# EAGLE design wfipic32host (EAGLE 9.6.2)
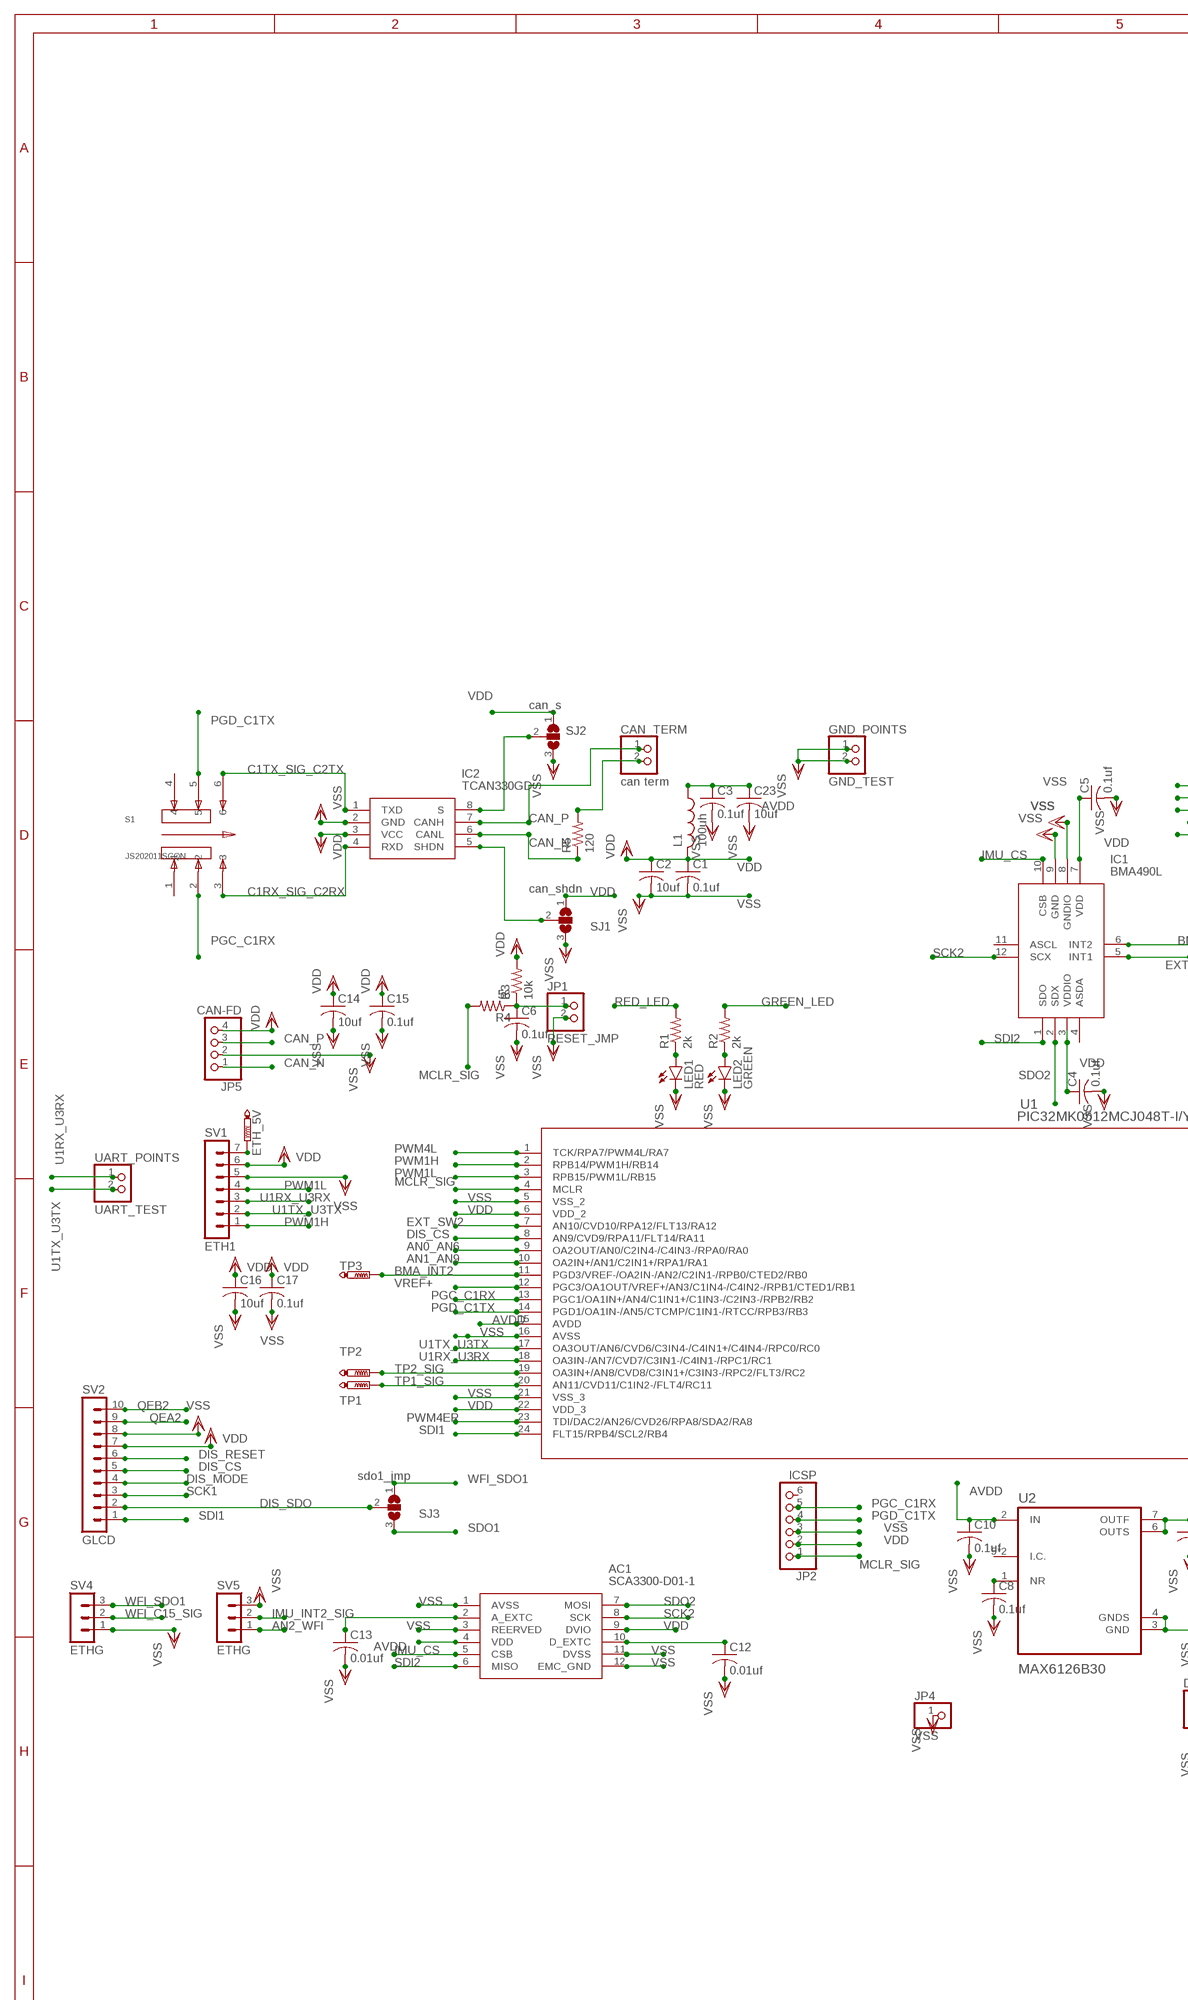
[diagram p0: schematic, sheet 1, part 1 of 2]
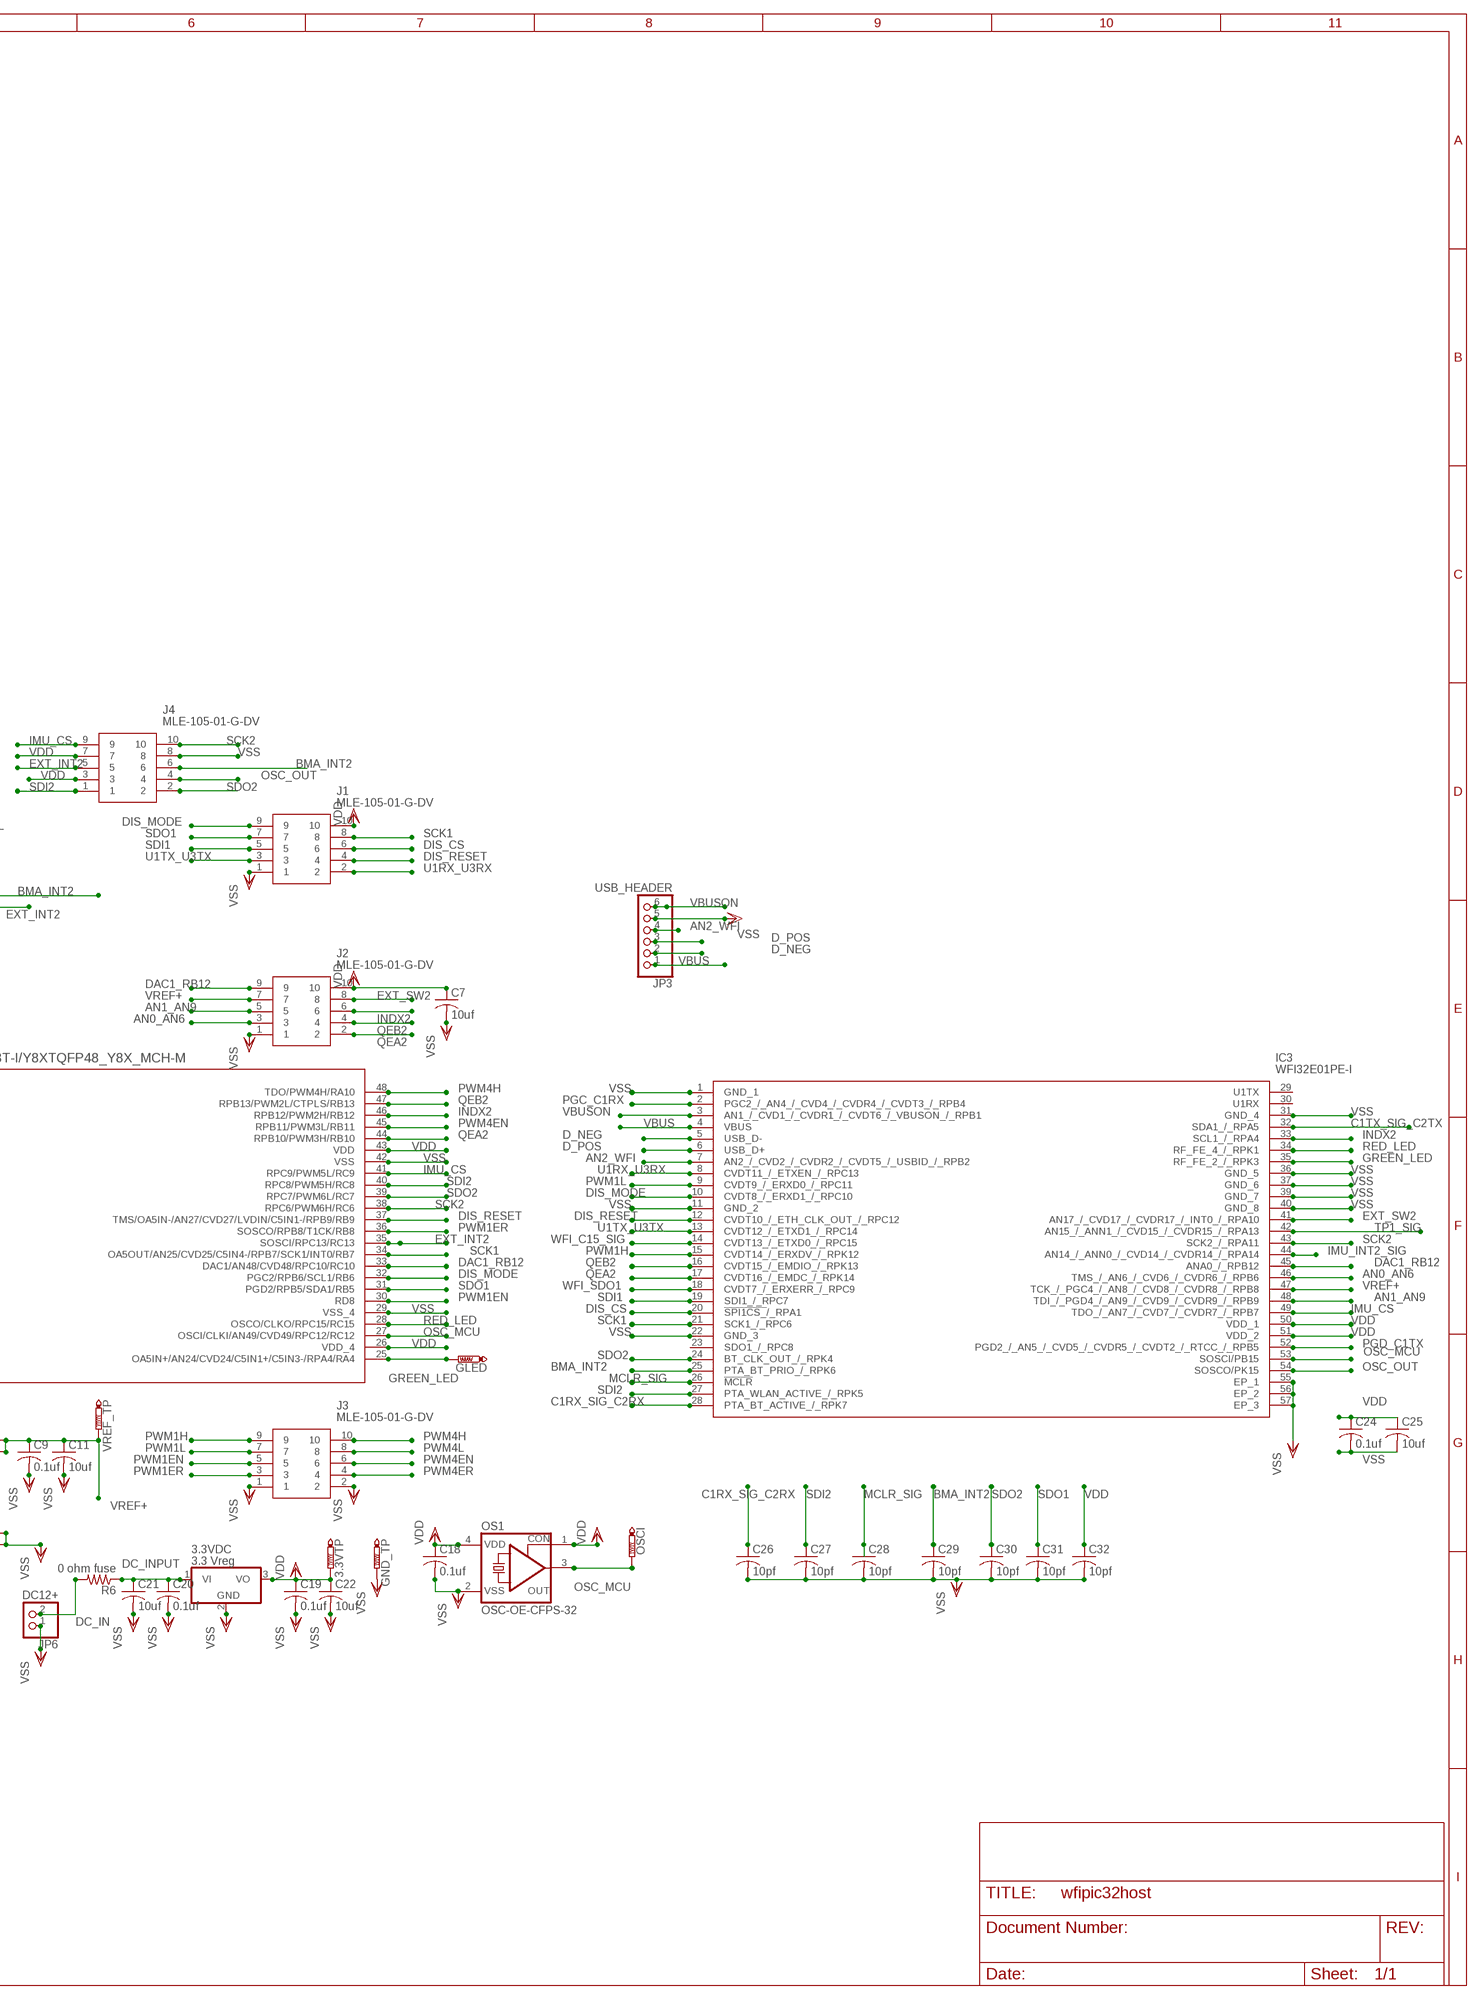
[diagram p1: schematic, sheet 1, part 2 of 2]

## Parts
3.3VDC  3.3 Vreg  7805TV  [TO220V]
3.3VTP  PTR1PAD1-13  [P1-13]
AC1  SCA3300-D01-1  [SCA3300]
C1  0.1uf  C-USC0805  [C0805]
C2  10uf  C-USC0805  [C0805]
C3  0.1uf  C-USC0805  [C0805]
C4  0.1uf  C-USC0805  [C0805]
C5  0.1uf  C-USC0805  [C0805]
C6  0.1uf  C-USC0805  [C0805]
C7  10uf  C-USC0805  [C0805]
C8  0.1uf  C-USC0805  [C0805]
C9  0.1uf  C-USC0805  [C0805]
C10  0.1uf  C-USC0805  [C0805]
C11  10uf  C-USC0805  [C0805]
C12  0.01uf  C-USC0805  [C0805]
C13  0.01uf  C-USC0805  [C0805]
C14  10uf  C-USC0805  [C0805]
C15  0.1uf  C-USC0805  [C0805]
C16  10uf  C-USC0805  [C0805]
C17  0.1uf  C-USC0805  [C0805]
C18  0.1uf  C-USC0805  [C0805]
C19  0.1uf  C-USC0805  [C0805]
C20  0.1uf  C-USC0805  [C0805]
C21  10uf  C-USC0805  [C0805]
C22  10uf  C-USC0805  [C0805]
C23  10uf  C-USC0805  [C0805]
C24  0.1uf  C-USC0805  [C0805]
C25  10uf  C-USC0805  [C0805]
C26  10pf  C-USC0402  [C0402]
C27  10pf  C-USC0402  [C0402]
C28  10pf  C-USC0402  [C0402]
C29  10pf  C-USC0402  [C0402]
C30  10pf  C-USC0402  [C0402]
C31  10pf  C-USC0402  [C0402]
C32  10pf  C-USC0402  [C0402]
CAN_TERM  can term  PINHD-1X2  [1X02]
ETH_5V  PTR1PAD1-13  [P1-13]
GLED  PTR1PAD1-13  [P1-13]
GND_POINTS  GND_TEST  PINHD-1X2  [1X02]
GND_TP  PTR1PAD1-13  [P1-13]
IC1  BMA490L  [BMA490L]
IC2  TCAN330GD  [SOIC127P600X175-8N]
IC3  WFI32E01PE-I  [WFI32E01PEI]
J1  MLE-105-01-G-DV  [MLE-105-01-G-DV]
J2  MLE-105-01-G-DV  [MLE-105-01-G-DV]
J3  MLE-105-01-G-DV  [MLE-105-01-G-DV]
J4  MLE-105-01-G-DV  [MLE-105-01-G-DV]
JP1  RESET_JMP  PINHD-1X2  [1X02]
JP2  ICSP  PINHD-1X6  [1X06]
JP3  USB_HEADER  PINHD-1X6  [1X06]
JP4  VSS  PINHD-1X1  [1X01]
JP5  CAN-FD  PINHD-1X4/90  [1X04/90]
JP6  DC12+  PINHD-1X2  [1X02]
L1  100uh  L-USL3216C  [L3216C]
LED1  RED  LEDCHIPLED_0603  [CHIPLED_0603]
LED2  GREEN  LEDCHIPLED_0603  [CHIPLED_0603]
OS1  OSC-OE-CFPS-32  [7.2X5.2-4-PAD]
OSCI  PTR1PAD1-13  [P1-13]
R1  2k  R-US_M0805  [M0805]
R2  2k  R-US_M0805  [M0805]
R3  10k  R-US_M0805  [M0805]
R4  56  R-US_M0805  [M0805]
R5  120  R-US_M0805  [M0805]
R6  0 ohm fuse  R-US_M1206  [M1206]
S1  JS202011SCQN  [SW_JS202011SCQN]
SJ1  can_shdn  SJ2W  [SJ_2]
SJ2  can_s  SJ2W  [SJ_2]
SJ3  sdo1_jmp  SJ2W  [SJ_2]
SV1  ETH1  MA07-1  [MA07-1]
SV2  GLCD  MA10-1  [MA10-1]
SV4  ETHG  MA03-1  [MA03-1]
SV5  ETHG  MA03-1  [MA03-1]
TP1  PTR1PAD1-13  [P1-13]
TP2  PTR1PAD1-13  [P1-13]
TP3  PTR1PAD1-13  [P1-13]
U1  PIC32MK0512MCJ048T-I/Y8XTQFP48_Y8X_MCH-M  [TQFP48_Y8X_MCH-M]
U2  MAX6126B30  [SOP65P490X110-8N]
UART_POINTS  UART_TEST  PINHD-1X2  [1X02]
VREF_TP  PTR1PAD1-13  [P1-13]

## Nets
AN0_AN6: IC3.46(TMS_/_AN6_/_CVD6_/_CVDR6_/_RPB6) J2.3 U1.9(OA2OUT/AN0/C2IN4-/C4IN3-/RPA0/RA0)
AN1_AN9: IC3.48(TDI_/_PGD4_/_AN9_/_CVD9_/_CVDR9_/_RPB9) J2.5 U1.10(OA2IN+/AN1/C2IN1+/RPA1/RA1)
AN2_WFI: IC3.7(AN2_/_CVD2_/_CVDR2_/_CVDT5_/_USBID_/_RPB2) JP3.4 SV5.1
AVDD [ncurrent]: AC1.4(VDD) C3.1 C10.1 C23.1 L1.1 U1.15(AVDD) U2.2(IN)
BMA_INT2: C29.1 IC1.6(INT2) IC3.25(PTA_BT_PRIO_/_RPK6) J4.6 TP3.TP U1.11(PGD3/VREF-/OA2IN-/AN2/C2IN1-/RPB0/CTED2/RB0)
C1RX_SIG_C2RX: C26.1 IC2.4(RXD) IC3.28(PTA_BT_ACTIVE_/_RPK7) S1.3
C1TX_SIG_C2TX: IC2.1(TXD) IC3.32(SDA1_/_RPA5) S1.6
CAN_N [diff_can]: IC2.6(CANL) JP5.1 R5.1
CAN_P [diff_can]: CAN_TERM.1 IC2.7(CANH) JP5.3
D_NEG: IC3.5(USB_D-) JP3.2
D_POS: IC3.6(USB_D+) JP3.3
DAC1_RB12: IC3.45(ANA0_/_RPB12) J2.9 U1.33(DAC1/AN48/CVD48/RPC10/RC10)
DC_IN [icurrent]: JP6.2 R6.2
DC_INPUT [icurrent]: 3.3VDC.1(VI) C20.1 C21.1 R6.1
DIS_CS: IC3.20(!SPI1CS_!/_RPA1) J1.6 SV2.5 U1.8(AN9/CVD9/RPA11/FLT14/RA11)
DIS_MODE: IC3.10(CVDT8_/_ERXD1_/_RPC10) J1.9 SV2.4 U1.32(PGC2/RPB6/SCL1/RB6)
DIS_RESET: IC3.12(CVDT10_/_ETH_CLK_OUT_/_RPC12) J1.4 SV2.6 U1.37(TMS/OA5IN-/AN27/CVD27/LVDIN/C5IN1-/RPB9/RB9)
DIS_SDO: SJ3.2 SV2.2
EXT_INT2: IC1.5(INT1) J4.5 U1.35(SOSCI/RPC13/RC13)
EXT_SW2: IC3.41(AN17_/_CVD17_/_CVDR17_/_INT0_/_RPA10) J2.8 U1.7(AN10/CVD10/RPA12/FLT13/RA12)
GREEN_LED: GLED.TP IC3.35(RF_FE_2_/_RPK3) R2.2 U1.25(OA5IN+/AN24/CVD24/C5IN1+/C5IN3-/RPA4/RA4)
IMU_CS: AC1.5(CSB) IC1.10(CSB) IC3.49(TDO_/_AN7_/_CVD7_/_CVDR7_/_RPB7) J4.9 U1.41(RPC9/PWM5L/RC9)
IMU_INT2_SIG: IC3.44(AN14_/_ANN0_/_CVD14_/_CVDR14_/_RPA14) SV5.2
INDX2: IC3.33(SCL1_/_RPA4) J2.6 U1.46(RPB12/PWM2H/RB12)
MCLR_SIG: C28.1 IC3.26(!MCLR) JP2.1 R4.2 U1.4(MCLR)
N$1: LED1.A R1.1
N$2: LED2.A R2.1
N$3: C6.1 JP1.1 R3.1 R4.1
N$4: C8.1 U2.1(NR)
N$7: AC1.10(D_EXTC) C12.1
N$8: ETH_5V.TP SV1.7
N$9: AC1.2(A_EXTC) C13.1
N$12: IC2.5(SHDN) SJ1.2
N$13: IC2.8(S) SJ2.2
N$15: CAN_TERM.2 R5.2
OSC_MCU: IC3.53(SOSCI/PB15) OS1.3(OUT) OSCI.TP U1.27(OSCI/CLKI/AN49/CVD49/RPC12/RC12)
OSC_OUT: IC3.54(SOSCO/PK15) J4.4
PGC_C1RX: IC3.2(PGC2_/_AN4_/_CVD4_/_CVDR4_/_CVDT3_/_RPB4) JP2.5 S1.2 U1.13(PGC1/OA1IN+/AN4/C1IN1+/C1IN3-/C2IN3-/RPB2/RB2)
PGD_C1TX: IC3.52(PGD2_/_AN5_/_CVD5_/_CVDR5_/_CVDT2_/_RTCC_/_RPB5) JP2.4 S1.5 U1.14(PGD1/OA1IN-/AN5/CTCMP/C1IN1-/RTCC/RPB3/RB3)
PWM1EN: J3.5 U1.30(RD8)
PWM1ER: J3.3 U1.36(SOSCO/RPB8/T1CK/RB8)
PWM1H: IC3.15(CVDT14_/_ERXDV_/_RPK12) J3.9 SV1.1 U1.2(RPB14/PWM1H/RB14)
PWM1L: IC3.9(CVDT9_/_ERXD0_/_RPC11) J3.7 SV1.4 U1.3(RPB15/PWM1L/RB15)
PWM4EN: J3.6 U1.45(RPB11/PWM3L/RB11)
PWM4ER: J3.4 U1.23(TDI/DAC2/AN26/CVD26/RPA8/SDA2/RA8)
PWM4H: J3.10 U1.48(TDO/PWM4H/RA10)
PWM4L: J3.8 U1.1(TCK/RPA7/PWM4L/RA7)
QEA2: IC3.17(CVDT16_/_EMDC_/_RPK14) J2.2 SV2.9 U1.44(RPB10/PWM3H/RB10)
QEB2: IC3.16(CVDT15_/_EMDIO_/_RPK13) J2.4 SV2.10 U1.47(RPB13/PWM2L/CTPLS/RB13)
RED_LED: IC3.34(RF_FE_4_/_RPK1) R1.2 U1.28(OSCO/CLKO/RPC15/RC15)
SCK1: IC3.21(SCK1_/_RPC6) J1.8 SV2.3 U1.34(OA5OUT/AN25/CVD25/C5IN4-/RPB7/SCK1/INT0/RB7)
SCK2: AC1.8(SCK) IC1.12(SCX) IC3.43(SCK2_/_RPA11) J4.10 U1.38(RPC6/PWM6H/RC6)
SDI1: IC3.19(SDI1_/_RPC7) J1.5 SV2.1 U1.24(FLT15/RPB4/SCL2/RB4)
SDI2: AC1.6(MISO) C27.1 IC1.1(SDO) IC3.27(PTA_WLAN_ACTIVE_/_RPK5) J4.1 U1.40(RPC8/PWM5H/RC8)
SDO1: C31.1 J1.7 SJ3.3 U1.31(PGD2/RPB5/SDA1/RB5)
SDO2: AC1.7(MOSI) C30.1 IC1.2(SDX) IC3.24(BT_CLK_OUT_/_RPK4) J4.2 U1.39(RPC7/PWM6L/RC7)
TP1_SIG: IC3.42(AN15_/_ANN1_/_CVD15_/_CVDR15_/_RPA13) TP1.TP U1.20(AN11/CVD11/C1IN2-/FLT4/RC11)
TP2_SIG: TP2.TP U1.19(OA3IN+/AN8/CVD8/C3IN1+/C3IN3-/RPC2/FLT3/RC2)
U1RX_U3RX: IC3.8(CVDT11_/_ETXEN_/_RPC13) J1.2 SV1.3 U1.18(OA3IN-/AN7/CVD7/C3IN1-/C4IN1-/RPC1/RC1) UART_POINTS.1
U1TX_U3TX: IC3.13(CVDT12_/_ETXD1_/_RPC14) J1.3 SV1.2 U1.17(OA3OUT/AN6/CVD6/C3IN4-/C4IN1+/C4IN4-/RPC0/RC0) UART_POINTS.2
VBUS: IC3.4(VBUS) JP3.1
VBUSON: IC3.3(AN1_/_CVD1_/_CVDR1_/_CVDT6_/_VBUSON_/_RPB1) JP3.6
VDD [ncurrent]: 3.3VDC.3(VO) 3.3VTP.TP AC1.9(DVIO) C1.1 C2.1 C4.1 C5.1 C7.1 C14.1 C15.1 C16.1 C17.1 C18.1 C19.1 C22.1 C24.1 C25.1 C32.1 IC1.3(VDDIO) IC1.7(VDD) IC2.3(VCC) IC3.50(VDD_1) IC3.51(VDD_2) J1.10 J2.10 J4.3 J4.7 JP2.2 JP5.4 L1.2 OS1.1(CON) OS1.4(VDD) R3.2 SJ1.1 SJ2.1 SV1.6 SV2.7 U1.6(VDD_2) U1.22(VDD_3) U1.26(VDD_4) U1.43(VDD)
VREF+: C9.1 C11.1 IC3.47(TCK_/_PGC4_/_AN8_/_CVD8_/_CVDR8_/_RPB8) J2.7 U1.12(PGC3/OA1OUT/VREF+/AN3/C1IN4-/C4IN2-/RPB1/CTED1/RB1) U2.6(OUTS) U2.7(OUTF) VREF_TP.TP
VSS [ncurrent]: 3.3VDC.2(GND) AC1.1(AVSS) AC1.3(REERVED) AC1.11(DVSS) AC1.12(EMC_GND) C1.2 C2.2 C3.2 C4.2 C5.2 C6.2 C7.2 C8.2 C9.2 C10.2 C11.2 C12.2 C13.2 C14.2 C15.2 C16.2 C17.2 C18.2 C19.2 C20.2 C21.2 C22.2 C23.2 C24.2 C25.2 C26.2 C27.2 C28.2 C29.2 C30.2 C31.2 C32.2 GND_POINTS.1 GND_POINTS.2 GND_TP.TP IC1.8(GNDIO) IC1.9(GND) IC2.2(GND) IC3.1(GND_1) IC3.11(GND_2) IC3.22(GND_3) IC3.31(GND_4) IC3.36(GND_5) IC3.37(GND_6) IC3.39(GND_7) IC3.40(GND_8) IC3.55(EP_1) IC3.56(EP_2) IC3.57(EP_3) J1.1 J2.1 J3.1 J3.2 J4.8 JP1.2 JP2.3 JP3.5 JP4.1 JP5.2 JP6.1 LED1.C LED2.C OS1.2(VSS) SJ1.3 SJ2.3 SV1.5 SV2.8 SV4.1 SV5.3 U1.5(VSS_2) U1.16(AVSS) U1.21(VSS_3) U1.29(VSS_4) U1.42(VSS) U2.3(GND) U2.4(GNDS)
WFI_C15_SIG: IC3.14(CVDT13_/_ETXD0_/_RPC15) SV4.2
WFI_SDO1: IC3.18(CVDT7_/_ERXERR_/_RPC9) SJ3.1 SV4.3
Unconnected: IC1.4(ASDA) IC1.11(ASCL) IC3.23(SDO1_/_RPC8) IC3.29(U1TX) IC3.30(U1RX) JP2.6 S1.1 S1.4 U2.5(I.C.) U2.8(I.C.)

## Library data of the parts
3.3VDC = linear:78*: Positive VOLTAGE REGULATOR Source: http://cache.national.com/ds/LM/LM78L05.pdf http://www.fairchildsemi.com/ds/LM/LM7805.pdf
3.3VTP ETH_5V GLED GND_TP OSCI TP1-TP3 VREF_TP = testpad:PTR1: TEST PIN
AC1 = SCA3300-D01-1:SCA3300-D01-1: Murata SCA3300-D01-1, 3-Axis Accelerometer, +/-1.5 +/-6g, 3 3.6 V, SPI, DFL/SMD 12-Pin Source: Datasheet <https://www.murata.com/~/media/webrenewal/products/sensor/accel/sca3300/sca3300-d01 industrial 3-axis accelerometer datasheet _a1.ashx> Check availability <https://pricing.snapeda.com/parts/SCA3300-D01-1/Murata%20Electronics/view-part?ref=eda>; AVAILABILITY: In Stock; DESCRIPTION: Accelerometer X, Y, Z Axis ±1.5g, 3g, 6g - -; MF: Murata Electronics; MP: SCA3300-D01-1; PACKAGE: Nonstandard Murata; PRICE: None; PURCHASE-URL: https://pricing.snapeda.com/search/part/SCA3300-D01-1/?ref=eda
C1-C32 = rcl:C-US: CAPACITOR, American symbol; SPICEPREFIX: C
CAN_TERM GND_POINTS JP1 JP6 UART_POINTS = pinhead:PINHD-1X2: PIN HEADER
IC1 = SamacSys_Parts:BMA490L: Accelerometers High-performance longevity acceleration sensor Source: Datasheet <https://www.mouser.es/datasheet/2/783/bst-bma490l-ds000-1878796.pdf>; DESCRIPTION: Accelerometers High-performance longevity acceleration sensor; HEIGHT: 1mm; MANUFACTURER_NAME: Bosch Sensortec; MANUFACTURER_PART_NUMBER: BMA490L; MOUSER_PART_NUMBER: 262-BMA490L; MOUSER_PRICE-STOCK: https://www.mouser.co.uk/ProductDetail/Bosch-Sensortec/BMA490L?qs=7MVldsJ5UawjTpioRTbJPQ%3D%3D
IC2 = TCAN330GD:TCAN330GD: 3.3-V CAN Transceivers with CAN FD (Flexible Data Rate) Source: Datasheet <http://www.ti.com/lit/gpn/tcan330g>; DESCRIPTION: 3.3-V CAN Transceivers with CAN FD (Flexible Data Rate); HEIGHT: 1.75mm; MANUFACTURER_NAME: Texas Instruments; MANUFACTURER_PART_NUMBER: TCAN330GD; MOUSER_PART_NUMBER: 595-TCAN330GD; MOUSER_PRICE-STOCK: https://www.mouser.co.uk/ProductDetail/Texas-Instruments/TCAN330GD?qs=9DwIlvx97ae6H3qgocd9Aw%3D%3D
IC3 = WFI32E01PE-I:WFI32E01PE-I: WiFi Modules - 802.11 54-pad Wi-Fi SoC module, 802.11 b/g/n, 1MB Flash, 320KB RAM, Crypto, PCB ant Source: Datasheet <https://ww1.microchip.com/downloads/aemDocuments/documents/WSG/ProductDocuments/DataSheets/PIC32MZ1025W104-MCU-and-WFI32E01-Module-with-Wi-Fi-and-Hardware-based-Security-Accelerator-Data-Sheet-DS70005425.pdf>; DESCRIPTION: WiFi Modules - 802.11 54-pad Wi-Fi SoC module, 802.11 b/g/n, 1MB Flash, 320KB RAM, Crypto, PCB ant; HEIGHT: 2.6mm; MANUFACTURER_NAME: Microchip; MANUFACTURER_PART_NUMBER: WFI32E01PE-I; MOUSER_PART_NUMBER: 579-WFI32E01PE-I; MOUSER_PRICE-STOCK: https://www.mouser.co.uk/ProductDetail/Microchip-Technology-Atmel/WFI32E01PE-I?qs=W%2FMpXkg%252BdQ6FpmXU%2Fd7PKw%3D%3D
J1-J4 = MLE-105-01-G-DV:MLE-105-01-G-DV: 10 Position, 1.00 mm Tiger Beam™ Cost-Effective Single Beam Socket Strip Source: Datasheet <http://suddendocs.samtec.com/prints/mle-1xx-xx-x-dv-x-mkt1.pdf>; DESCRIPTION: 10 Position, 1.00 mm Tiger Beam&trade; Cost-Effective Single Beam Socket Strip; HEIGHT: mm; MANUFACTURER_NAME: SAMTEC; MANUFACTURER_PART_NUMBER: MLE-105-01-G-DV; MOUSER_PART_NUMBER: 200-MLE10501GDV; MOUSER_PRICE-STOCK: https://www.mouser.co.uk/ProductDetail/Samtec/MLE-105-01-G-DV?qs=rU5fayqh%252BE2dXiDvl4XeQQ%3D%3D
JP2 JP3 = pinhead:PINHD-1X6: PIN HEADER
JP4 = pinhead:PINHD-1X1: PIN HEADER
JP5 = pinhead:PINHD-1X4: PIN HEADER
L1 = rcl:L-US: INDUCTOR, American symbol; SPICEPREFIX: L
LED1 LED2 = led:LED: LED OSRAM: - CHIPLED LG R971, LG N971, LY N971, LG Q971, LY Q971, LO R971, LY R971 LH N974, LH R974 LS Q976, LO Q976, LY Q976 LO Q996 - Hyper CHIPLED LW Q18S LB Q993, LB Q99A, LB R99A - SideLED LS A670, LO A670, LY A670, LG A670, LP A670 LB A673, LV A673, LT A673, LW A673 LH A674 LY A675 LS A676, LA A676, LO A676, LY A676, LW A676 LS A679, LY A679, LG A679 - Hyper Micro SIDELED® LS Y876, LA Y876, LO Y876, LY Y876 LT Y87S - SmartLED LW L88C, LW L88S LB L89C, LB L89S, LG L890 LS L89K, LO L89K, LY L89K LS L896, LA L896, LO L896, LY L896 - TOPLED LS T670, LO T670, LY T670, LG T670, LP T670 LSG T670, LSP T670, LSY T670, LOP T670, LYG T670 LG T671, LOG T671, LSG T671 LB T673, LV T673, LT T673, LW T673 LH T674 LS T676, LA T676, LO T676, LY T676, LB T676, LH T676, LSB T676, LW T676 LB T67C, LV T67C, LT T67C, LS T67K, LO T67K, LY T67K, LW E67C LS E67B, LA E67B, LO E67B, LY E67B, LB E67C, LV E67C, LT E67C LW T67C LS T679, LY T679, LG T679 LS T770, LO T770, LY T770, LG T770, LP T770 LB T773, LV T773, LT T773, LW T773 LH T774 LS E675, LA E675, LY E675, LS T675 LS T776, LA T776, LO T776, LY T776, LB T776 LHGB T686 LT T68C, LB T68C - Hyper Mini TOPLED® LB M676 - Mini TOPLED Santana® LG M470 LS M47K, LO M47K, LY M47K Source: http://www.osram.convergy.de LUXEON: - LUMILED® LXK2-PW12-R00, LXK2-PW12-S00, LXK2-PW14-U00, LXK2-PW14-V00 LXK2-PM12-R00, LXK2-PM12-S00, LXK2-PM14-U00 LXK2-PE12-Q00, LXK2-PE12-R00, LXK2-PE12-S00, LXK2-PE14-T00, LXK2-PE14-U00 LXK2-PB12-K00, LXK2-PB12-L00, LXK2-PB12-M00, LXK2-PB14-N00, LXK2-PB14-P00, LXK2-PB14-Q00 LXK2-PR12-L00, LXK2-PR12-M00, LXK2-PR14-Q00, LXK2-PR14-R00 LXK2-PD12-Q00, LXK2-PD12-R00, LXK2-PD12-S00 LXK2-PH12-R00, LXK2-PH12-S00 LXK2-PL12-P00, LXK2-PL12-Q00, LXK2-PL12-R00 Source: www.luxeon.com KINGBRIGHT: KA-3528ASYC Source: www.kingbright.com
OS1 = IQD-Frequency-Products:OSC-OE: OSCILLATOR WITH OE
R1-R6 = rcl:R-US_: RESISTOR, American symbol; SPICEPREFIX: R
S1 = JS202011SCQN_fixed:JS202011SCQN: JS Series DPDT On-On Gull Wing Surface Mount Subminiature Slide Switch; AVAILABILITY: Unavailable; DESCRIPTION: JS Series DPDT On-On Gull Wing Surface Mount Subminiature Slide Switch; MF: C&K; MP: JS202011SCQN; PACKAGE: None; PRICE: None
SJ1-SJ3 = jumper:SJ2W: SMD solder JUMPER
SV1 = con-lstb:MA07-1: PIN HEADER; OC_FARNELL: unknown; OC_NEWARK: unknown
SV2 = con-lstb:MA10-1: PIN HEADER; OC_FARNELL: unknown; OC_NEWARK: unknown
SV4 SV5 = con-lstb:MA03-1: PIN HEADER; OC_FARNELL: unknown; OC_NEWARK: unknown
U1 = 2022-08-07_22-50-41_Library:PIC32MK0512MCJ048T-I/Y8X; COPYRIGHT: Copyright (C) 2022 Ultra Librarian. All rights reserved.; MANUFACTURER_PART_NUMBER: PIC32MK0512MCJ048T-I/Y8X; MFR_NAME: Microchip
U2 = MAX6126B30:MAX6126B30; DESCRIPTION: Series Voltage Reference IC Fixed 3V V ±0.1% 10 mA 8-uMAX-EP|8-uSOP-EP; DIGI-KEY_PART_NUMBER: MAX6126B30+T-ND; MF: Maxim Integrated; MP: MAX6126B30+T; PACKAGE: MICRO MAX-8 Maxim; PURCHASE-URL: https://pricing.snapeda.com/search/part/MAX6126B30+T/?ref=eda

## Net classes
1 icurrent: width 0.305 mm
2 ncurrent: width 0.203 mm
3 diff_can: width 0.051 mm

## Board
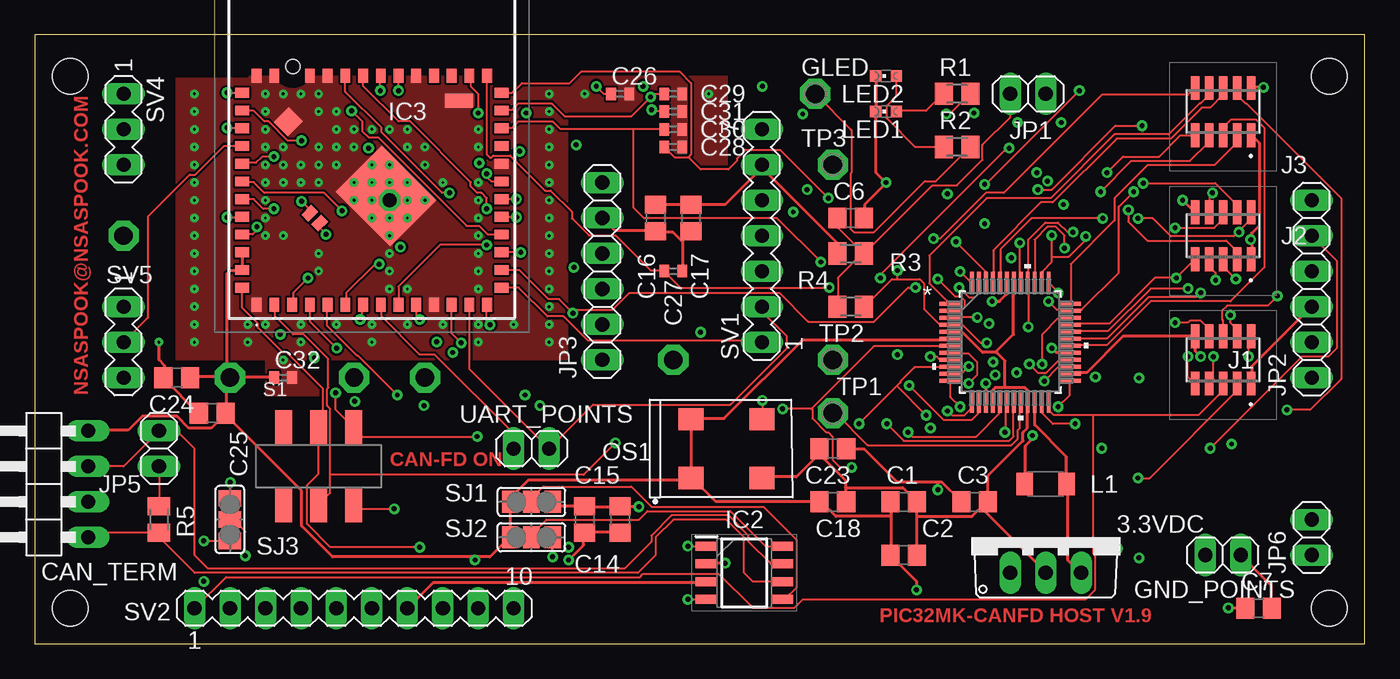
[diagram p2: board, top side]
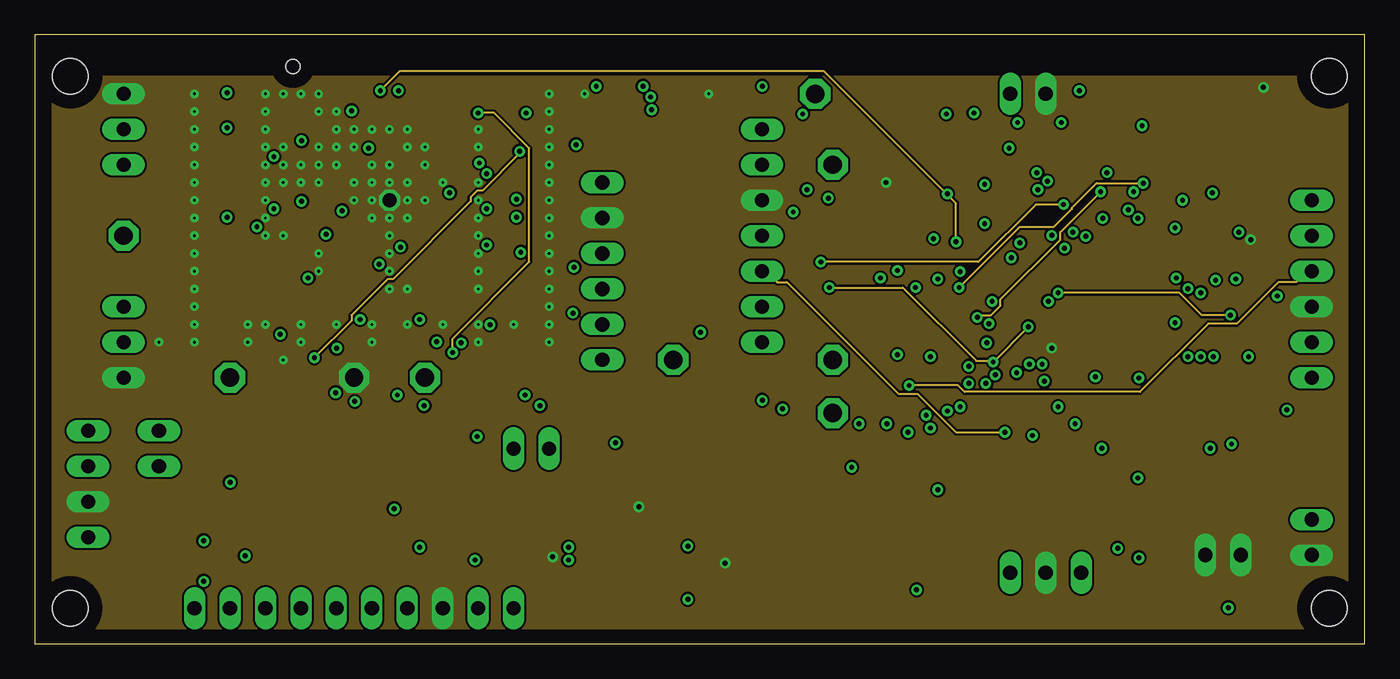
[diagram p3: board, inner layer Route2]
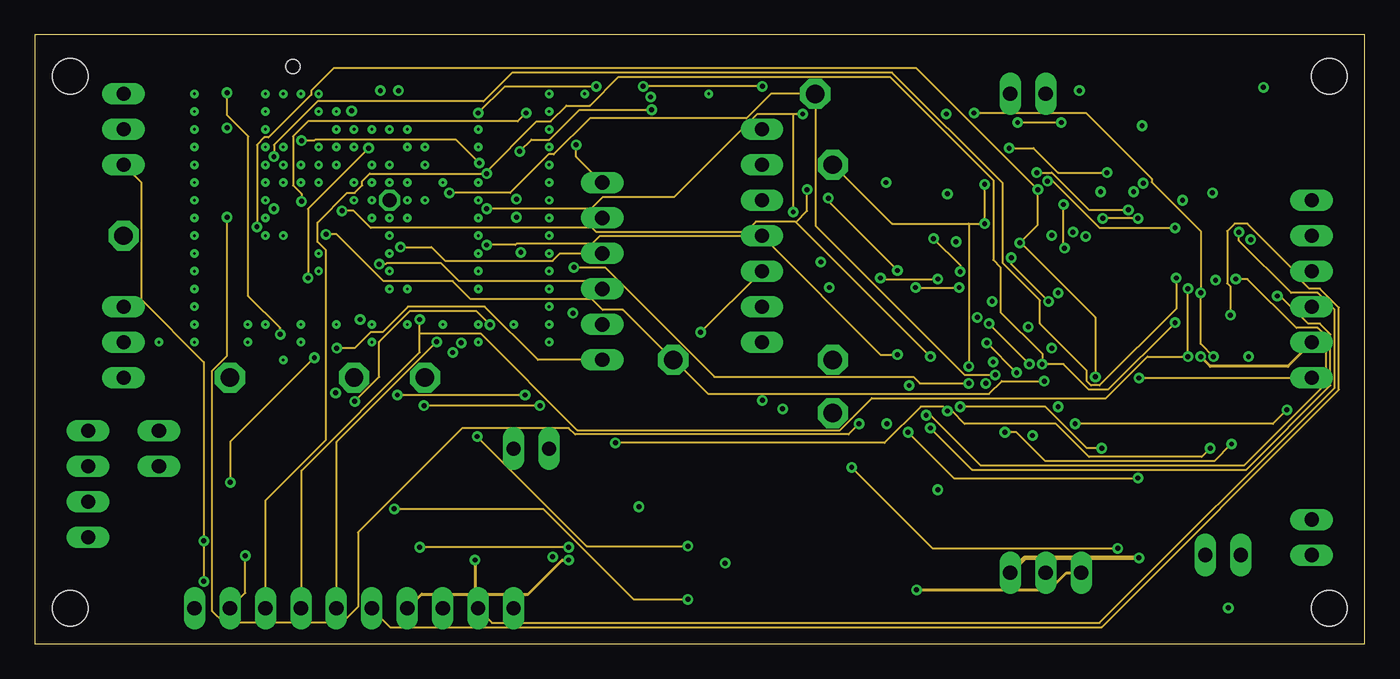
[diagram p4: board, inner layer Route15]
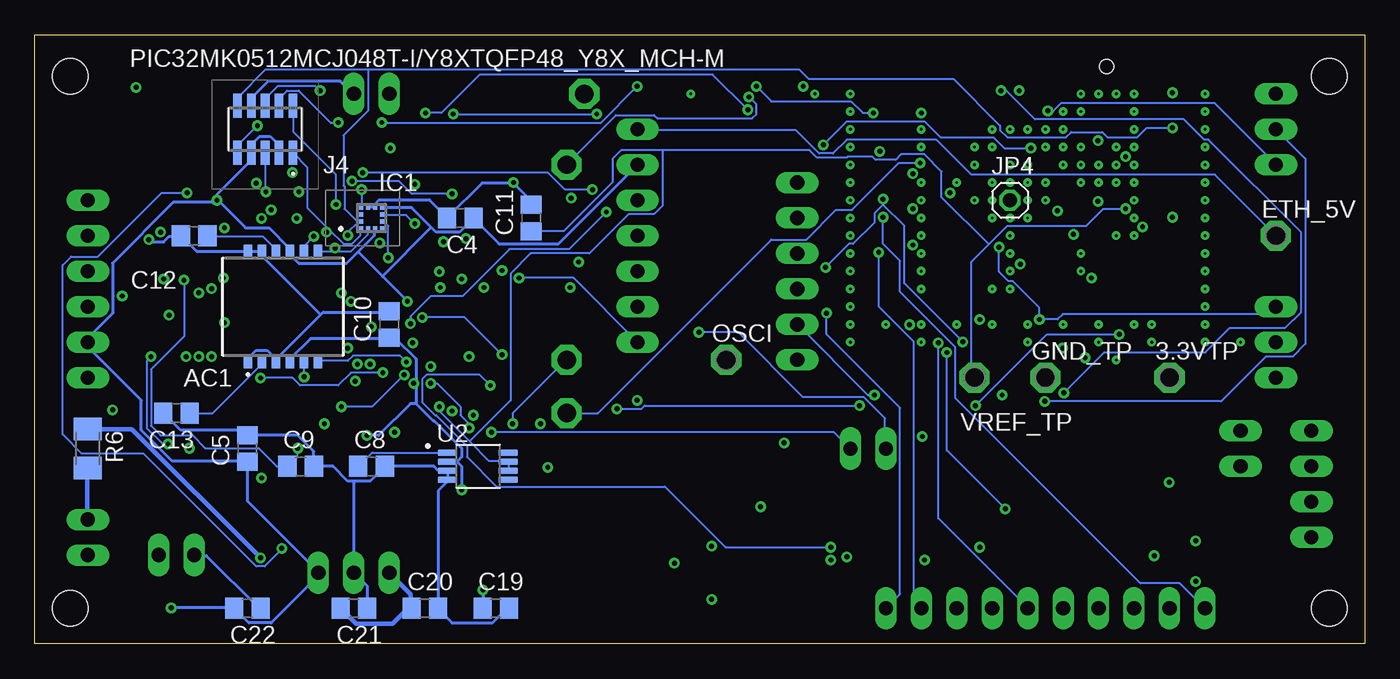
[diagram p5: board, bottom side, seen from below]

Size 95.23 x 43.59 mm. Coordinates in mm from the lower left corner, seen from the top.
Outline: 0,0 95.23,0 95.23,43.59 0,43.59 0,0
Copper layers (1+2*15+16): Top 0.035mm / dielectric 1.5mm / Route2 0.035mm / dielectric 0.15mm / Route15 0.035mm / dielectric 0.2mm / Bottom 0.035mm
Design rules "default *": minimum track width 6mil, minimum drill 0.35mm, track to track 6mil, track to pad 6mil, pad to pad 6mil, via to via 6mil, smd to smd 6mil, copper to edge 40mil, drill to drill 6mil, minimum pad ring 10mil, minimum via ring 8mil, stop-mask expansion 4mil, vias tented up to drill 0mil, thermal gap 10mil
Holes 2.54 mm at 2.54,2.54 2.54,40.64 92.71,40.64 92.71,2.54
Holes 1 mm at 18.47,41.33
tKeepout: area 10.2,40.6 to 38.1,43.2; area 26.7,26.7 to 27.9,29.2; area 26.7,27.9 to 30.5,29.2; area 27.9,29.2 to 30.5,30.5; area 16.5,25.4 to 19.1,27.9; area 21.6,25.4 to 24.1,30.5; area 19.1,33 to 30.5,36.8
bKeepout: area 10.2,40.6 to 38.1,43.2
tRestrict: area 10.2,40.6 to 12.7,41.9; area 35.6,40.6 to 38.1,43.2; area 12.7,40.6 to 15.2,43.2; area 33,40.6 to 35.6,43.2
bRestrict: area 10.2,40.6 to 38.1,43.2
vRestrict: area 73.7,20.3 to 81.3,27.9; area 69.8,29.2 to 72.4,31.8; area 62.2,11.4 to 64.8,14; area 16.5,8.9 to 24.1,16.5; area 35.6,20.3 to 38.1,40.6; area 10.2,20.3 to 12.7,40.6; area 10.2,41.9 to 35.6,43.2; area 35.6,40.6 to 38.1,43.2; area 11.4,40.6 to 15.2,43.2; area 21.6,25.4 to 24.1,30.5; area 16.5,25.4 to 19.1,27.9; area 26.7,26.7 to 30.5,30.5; 1 more areas

### Footprints (pad centres in the part's own frame; a part is rotated, then mirrored left to right if it is on the bottom)
TO220V = drill 1.016 long: 1 -2.54,-2.54; 2 0,-2.54; 3 2.54,-2.54
P1-13 = drill 1.321 pad 2.159 octagon: TP 0,0
SCA3300 = smd 0.61 x 0.98: 1 -2.5,-3.935; 2 -1.5,-3.935; 3 -0.5,-3.935; 4 0.5,-3.935; 5 1.5,-3.935; 6 2.5,-3.935; 7 2.5,3.935; 8 1.5,3.935; 9 0.5,3.935; 10 -0.5,3.935; 11 -1.5,3.935; 12 -2.5,3.935
C0805 = smd 1.3 x 1.5: 1 -0.95,0; 2 0.95,0
C0402 = smd 0.7 x 0.9: 1 -0.65,0; 2 0.65,0
1X02 = drill 1.016 long: 1 -1.27,0; 2 1.27,0
BMA490L = smd 0.3 x 0.35: 1 -0.75,-0.775; 2 -0.25,-0.775; 3 0.25,-0.775; 4 0.75,-0.775; 7 0.75,0.775; 8 0.25,0.775; 9 -0.25,0.775; 10 -0.75,0.775 | smd 0.35 x 0.3: 5 0.775,-0.25; 6 0.775,0.25; 11 -0.775,0.25; 12 -0.775,-0.25
SOIC127P600X175-8N = smd 1.528 x 0.65: 1 -2.711,1.905; 2 -2.711,0.635; 3 -2.711,-0.635; 4 -2.711,-1.905; 5 2.711,-1.905; 6 2.711,-0.635; 7 2.711,0.635; 8 2.711,1.905
WFI32E01PEI = smd 0.7 x 1: 1 -8.25,-11.28; 2 -6.98,-11.28; 3 -5.71,-11.28; 4 -4.44,-11.28; 5 -3.17,-11.28; 6 -1.9,-11.28; 7 -0.63,-11.28; 8 0.64,-11.28; 9 1.91,-11.28; 10 3.18,-11.28; 11 4.45,-11.28; 12 5.72,-11.28; 13 6.99,-11.28; 14 8.26,-11.28; 27 8.26,5.09; 28 6.99,5.09; 29 5.72,5.09; 30 4.45,5.09; 31 3.18,5.09; 32 1.91,5.09; 33 0.64,5.09; 34 -0.63,5.09; 35 -1.9,5.09; 36 -3.17,5.09; 37 -4.44,5.09; 39 -6.98,5.09; 40 -8.25,5.09 | smd 1 x 0.7: 15 9.29,-10.08; 16 9.29,-8.81; 17 9.29,-7.54; 18 9.29,-6.27; 19 9.29,-5; 20 9.29,-3.73; 21 9.29,-2.46; 22 9.29,-1.19; 23 9.29,0.08; 24 9.29,1.35; 25 9.29,2.62; 26 9.29,3.89; 41 -9.28,3.89; 42 -9.28,2.62; 43 -9.28,1.35; 44 -9.28,0.08; 45 -9.28,-1.19; 46 -9.28,-2.46; 47 -9.28,-3.73; 48 -9.28,-5; 49 -9.28,-6.27; 50 -9.28,-7.54; 51 -9.28,-8.81; 52 -9.28,-10.08 | smd 1 x 0.7 rotated 45: 53 -3.74,-5.44; 54 -4.44,-4.74 | smd 5.5 x 4.64 rotated 135: 55 1,-3.51 | smd 2 x 1: 56 6.26,3.33 | smd 1.5 x 1.42 rotated 45: 57 -5.99,1.82
MLE-105-01-G-DV = smd 0.61 x 1.709: 1 2,-1.685; 2 2,1.685; 3 1,-1.685; 4 1,1.685; 5 0,-1.685; 6 0,1.685; 7 -1,-1.685; 8 -1,1.685; 9 -2,-1.685; 10 -2,1.685
1X06 = drill 1.016 long: 1 -6.35,0; 2 -3.81,0; 3 -1.27,0; 4 1.27,0; 5 3.81,0; 6 6.35,0
1X01 = drill 1.016 octagon: 1 0,0
1X04/90 = drill 1.016 long: 1 -3.81,-3.81; 2 -1.27,-3.81; 3 1.27,-3.81; 4 3.81,-3.81
L3216C = smd 1.2 x 1.6: 1 -1.5,0; 2 1.5,0
CHIPLED_0603 = smd 0.8 x 0.8: A 0,-0.75; C 0,0.75
7.2X5.2-4-PAD = smd 1.8 x 1.6: 1 -2.54,-2.1; 2 2.54,-2.1; 3 2.54,2.1; 4 -2.54,2.1
M0805 = smd 1.3 x 1.6: 1 -0.95,0; 2 0.95,0
M1206 = smd 1.6 x 2: 1 -1.4,0; 2 1.4,0
SW_JS202011SCQN = smd 1.2 x 2.5: 1 -2.5,-2.75; 2 0,-2.75; 3 2.5,-2.75; 4 -2.5,2.75; 5 0,2.75; 6 2.5,2.75
SJ_2 = smd 1.168 x 1.6: 1 -1.524,0; 2 0,0; 3 1.524,0
MA07-1 = drill 1.016 long: 1 -7.62,0; 2 -5.08,0; 3 -2.54,0; 4 0,0; 5 2.54,0; 6 5.08,0; 7 7.62,0
MA10-1 = drill 1.016 long: 1 -11.43,0; 2 -8.89,0; 3 -6.35,0; 4 -3.81,0; 5 -1.27,0; 6 1.27,0; 7 3.81,0; 8 6.35,0; 9 8.89,0; 10 11.43,0
MA03-1 = drill 1.016 long: 1 -2.54,0; 2 0,0; 3 2.54,0
TQFP48_Y8X_MCH-M = smd 1.549 x 0.279: 1 -4.28,2.75; 2 -4.28,2.25; 3 -4.28,1.75; 4 -4.28,1.25; 5 -4.28,0.75; 6 -4.28,0.25; 7 -4.28,-0.25; 8 -4.28,-0.75; 9 -4.28,-1.25; 10 -4.28,-1.75; 11 -4.28,-2.25; 12 -4.28,-2.75; 25 4.28,-2.75; 26 4.28,-2.25; 27 4.28,-1.75; 28 4.28,-1.25; 29 4.28,-0.75; 30 4.28,-0.25; 31 4.28,0.25; 32 4.28,0.75; 33 4.28,1.25; 34 4.28,1.75; 35 4.28,2.25; 36 4.28,2.75 | smd 0.279 x 1.549: 13 -2.75,-4.28; 14 -2.25,-4.28; 15 -1.75,-4.28; 16 -1.25,-4.28; 17 -0.75,-4.28; 18 -0.25,-4.28; 19 0.25,-4.28; 20 0.75,-4.28; 21 1.25,-4.28; 22 1.75,-4.28; 23 2.25,-4.28; 24 2.75,-4.28; 37 2.75,4.28; 38 2.25,4.28; 39 1.75,4.28; 40 1.25,4.28; 41 0.75,4.28; 42 0.25,4.28; 43 -0.25,4.28; 44 -0.75,4.28; 45 -1.25,4.28; 46 -1.75,4.28; 47 -2.25,4.28; 48 -2.75,4.28
SOP65P490X110-8N = smd 1.42 x 0.47: 1 -2.165,0.975; 2 -2.165,0.325; 3 -2.165,-0.325; 4 -2.165,-0.975; 5 2.165,-0.975; 6 2.165,-0.325; 7 2.165,0.325; 8 2.165,0.975

### Placement (x,y rotation side)
3.3VDC  72.39,7.62 0 top
3.3VTP  13.97,19.05 0 bottom
AC1  77.47,24.13 0 bottom
C1  62.23,10.16 0 top
C2  62.23,6.35 0 top
C3  67.31,10.16 0 top
C4  64.77,30.48 180 bottom
C5  80.01,13.97 90 bottom
C6  58.42,30.48 0 top
C7  87.63,2.54 0 top
C8  71.12,12.7 0 bottom
C9  76.2,12.7 0 bottom
C10  69.85,22.86 90 bottom
C11  59.69,30.48 90 bottom
C12  83.82,29.21 180 bottom
C13  85.09,16.51 180 bottom
C14  39.37,8.89 90 top
C15  41.91,8.89 90 top
C16  44.45,30.48 270 top
C17  46.99,30.48 270 top
C18  57.15,10.16 0 top
C19  62.23,2.54 0 bottom
C20  67.31,2.54 0 bottom
C21  72.39,2.54 0 bottom
C22  80.01,2.54 0 bottom
C23  57.15,13.97 180 top
C24  10.16,19.05 180 top
C25  12.7,16.51 180 top
C26  41.91,39.37 0 top
C27  45.72,26.67 0 top
C28  45.72,35.56 0 top
C29  45.72,39.37 0 top
C30  45.72,36.83 0 top
C31  45.72,38.1 0 top
C32  17.78,19.05 0 top
CAN_TERM  8.89,13.97 270 top
ETH_5V  6.35,29.21 0 bottom
GLED  55.88,39.37 0 top
GND_POINTS  85.09,6.35 180 top
GND_TP  22.86,19.05 0 bottom
IC1  71.12,30.48 0 bottom
IC2  50.8,5.08 0 top
IC3  24.13,35.56 0 top
J1  85.09,20.32 0 top
J2  85.09,29.21 0 top
J3  85.09,38.1 0 top
J4  78.74,36.83 0 bottom
JP1  71.12,39.37 0 top
JP2  91.44,25.4 90 top
JP3  40.64,26.67 90 top
JP4  25.4,31.75 0 bottom
JP5  0,11.43 90 top
JP6  91.44,7.62 90 top
L1  72.39,11.43 0 top
LED1  60.96,38.1 90 top
LED2  60.96,40.64 90 top
OS1  49.53,13.97 0 top
OSCI  45.72,20.32 0 bottom
R1  66.04,39.37 0 top
R2  66.04,35.56 0 top
R3  58.42,27.94 180 top
R4  58.42,24.13 0 top
R5  8.89,8.89 90 top
R6  91.44,13.97 270 bottom
S1  20.32,12.7 0 top
SJ1  35.56,10.16 0 top
SJ2  35.56,7.62 0 top
SJ3  13.97,8.89 90 top
SV1  52.07,29.21 90 top
SV2  22.86,2.54 0 top
SV4  6.35,36.83 270 top
SV5  6.35,21.59 270 top
TP1  57.15,16.51 0 top
TP2  57.15,20.32 0 top
TP3  57.15,34.29 0 top
U1  69.85,21.59 0 top
U2  63.5,12.7 0 bottom
UART_POINTS  35.56,13.97 0 top
VREF_TP  27.94,19.05 0 bottom

### Tracks (layer width: path | path; a pad name or v marks a point on that pad's centre or on a via)
AN0_AN6  (via drill 0.35)
  Top 0.152: v22,30.99 20.7,32.28 16.43,32.28 15.67,33.05 14.91,33.05 IC3.46 | v64.14,20.55 64.59,20.55 64.75,20.4 65.51,20.4 U1.9 | v78.31,31.06 78.31,30.23 79.68,28.85 85.32,28.85 86.08,28.09 86.08,27.56 J2.3
  Route15 0.152: v22,30.99 22.84,30.99 24.05,29.77 39.9,29.77 40.21,29.46 50.88,29.46 51.64,30.23 54.46,30.23 54.5,30.19 | v64.14,20.55 54.5,30.19 | v78.31,31.06 75.49,31.06 72.82,33.73 v71.75,33.73 | v55.3,32.51 55.3,30.99 54.5,30.19
  Bottom 0.152: v71.75,33.73 58.5,33.73 57.28,32.51 v55.3,32.51
AN1_AN9  (via drill 0.35)
  Top 0.152: v13.77,30.53 14.83,30.53 IC3.48 | 61.73,18.45 62,18.72 62,18.8 62.99,19.79 65.51,19.79 U1.10 | 61.73,18.45 v59.03,15.75 | J2.5 85.09,27.03 v86,26.11 | 61.73,18.45 v63.83,16.36
  Route15 0.152: v13.77,30.53 13.77,20.62 12.7,19.56 12.7,2.34 13.54,1.5 22,1.5 23.14,2.64 23.14,7.98 30.61,15.44 38.23,15.44 38.68,14.99 58.27,14.99 v59.03,15.75 | v86,26.11 86.84,26.11 90.35,22.61 91.87,22.61 92.48,22 92.48,18.64 86.61,12.78 67.72,12.78 64.14,16.36 v63.83,16.36
AN2_WFI  (via drill 0.35)
  Top 0.152: v23.29,23.22 23.44,23.37 23.44,24.21 IC3.7
  Route15 0.152: JP3.4 37.62,27.94 37.08,27.41 29.39,27.41 28.4,28.4 v26.19,28.4
  Bottom 0.152: SV5.1 6.38,24.13 6.91,23.6 21.62,23.6 22,23.22 v23.29,23.22 23.29,24.05 25.2,25.96 25.5,25.96 26.19,26.64 v26.19,28.4
AVDD  (via drill 0.35)
  Top 0.203: 64.67,11.56 64.97,11.56 66.34,10.18 C3.1 | 64.67,11.56 61.77,11.56 59.41,13.92 58.12,13.92 C23.1 | v68.1,18.64 68.1,17.35 U1.15 | v71.45,14.91 71.45,14.68 70.92,14.15 70.92,11.56 L1.1 | v64.67,11.02 64.67,11.56
  Bottom 0.203: AC1.4 76.94,20.24 76.94,20.4 75.49,21.84 69.85,21.84 C10.1 69.77,21.84 69.39,21.84 67.95,20.4 67.95,18.64 | 67.95,17.2 66.73,15.98 66.65,15.98 64.67,13.99 64.67,13.39 64.97,13.08 65.66,13.08 U2.2 64.97,13 64.67,12.7 v64.67,11.02 | 67.95,18.64 67.95,17.2 | v68.1,18.64 67.95,18.64 | v71.45,14.91 70.61,14.91 68.33,17.2 67.95,17.2
BMA_INT2  (via drill 0.35)
  Top 0.152: C29.1 44.32,39.37 v44.09,39.14 42.72,37.77 37.92,37.77 37.01,38.68 34.65,38.68 34.19,38.23 33.43,38.23 IC3.25 | v66.88,19.86 66.42,19.41 65.58,19.41 U1.11 | v74.8,39.6 68.1,32.89 v68.02,32.89
  Route15 0.152: 66.88,30.07 61.39,30.07 57.2,34.27 TP3.TP | 66.88,30.07 v68.02,30.07 v68.02,32.89 | 66.88,30.07 v66.88,19.86
  Bottom 0.152: v68.02,30.07 68.63,30.68 70.31,30.68 IC1.6 | v74.8,39.6 75.11,39.9 77.85,39.9 78.69,39.06 78.69,38.53 J4.6 | v44.09,39.14 43.56,38.61 43.56,37.92 43.87,37.62 50.65,37.62 50.88,37.85 53.62,37.85 57.12,34.34 TP3.TP
C1RX_SIG_C2RX  (via drill 0.35)
  Top 0.152: C26.1 40.74,39.37 v40.21,39.9 | v31.75,38 31.75,39.37 31.22,39.9 31.22,40.51 31.14,40.59 IC3.28 | v46.76,3.17 IC2.4 | v25.73,9.65 23.06,9.65 22.84,9.88 S1.3
  Route2 0.152: v31.75,38 32.89,38 35.41,35.48 35.41,27.33 29.92,21.84 v29.92,20.85
  Route15 0.152: v40.21,39.9 33.66,39.9 v31.75,38 | v46.76,3.17 42.88,3.17 36.4,9.65 v25.73,9.65
  Bottom 0.152: v29.92,20.85 29.92,13.84 v25.73,9.65
C1TX_SIG_C2TX  (via drill 0.35)
  Top 0.152: v26.04,39.6 26.04,40.59 IC3.32 | v21.54,17.96 21.54,16.74 22.76,15.52 S1.6 22.84,15.44 23.44,14.83 v31.67,14.83 | v46.76,6.98 IC2.1
  Route15 0.152: v46.76,6.98 39.52,6.98 v31.67,14.83
  Bottom 0.152: v26.04,39.6 25.65,39.6 23.6,37.54 12.93,37.54 11.48,36.09 11.18,36.09 4.55,29.46 4.55,23.75 5.69,22.61 9.65,22.61 11.41,20.85 18.64,20.85 v21.54,17.96
CAN_N
  Top 0.152: IC2.6 51.44,4.45 50.8,5.08 50.8,7.62 49.53,8.89 45.72,8.89 44.45,7.62 44.45,6.35 43.18,5.08 11.43,5.08 8.89,7.62 R5.1 4.13,7.94 JP5.1
CAN_P
  Top 0.152: JP5.3 6.35,12.7 CAN_TERM.1 10.16,15.24 11.43,13.97 11.43,6.35 12.4,5.38 42.22,5.38 44.15,7.31 44.15,7.75 45.59,9.2 49.66,9.2 51.11,7.75 51.11,7.31 52.7,5.71 IC2.7
D_NEG  (via drill 0.35)
  Top 0.152: v25.96,17.8 23.14,20.62 23.06,20.62 20.93,22.76 20.93,24.21 IC3.5
  Route15 0.152: v35.1,17.8 v25.96,17.8
  Bottom 0.152: v35.1,17.8 35.56,17.8 40.59,22.84 JP3.2
D_POS  (via drill 0.35)
  Top 0.152: v24.66,27.18 24.36,27.18 22.3,25.12 22.3,24.28 IC3.6
  Route15 0.152: v24.66,27.18 25.12,27.18 25.2,27.25 29.08,27.25 30.38,25.96 40.06,25.96 40.59,25.42 JP3.3
DAC1_RB12  (via drill 0.35)
  Top 0.152: v17.12,34.87 16.28,34.87 15.82,34.42 14.91,34.42 IC3.45 | J2.9 83.03,27.48 v81.74,26.19 80.21,26.19 76.94,22.91 74.19,22.91 U1.33
  Route15 0.152: v17.12,34.87 17.12,35.71 20.24,38.84 32.13,38.84 34.19,40.89 61.39,40.89 69.32,32.97 69.32,27.25 71.98,24.59 71.98,22.91 75.34,19.56 75.34,18.8 75.64,18.49 76.25,18.49 81.74,23.98 v81.74,26.19
DC_IN
  Bottom 0.305: R6.2 91.49,12.55 91.49,8.89 JP6.2
DC_INPUT  (via drill 0.35)
  Route15 0.305: v79.07,6.15 70.92,6.15 3.3VDC.1
  Bottom 0.305: 3.3VDC.1 68.33,3.56 68.33,2.56 C20.1 68.48,2.56 69.62,1.42 72.21,1.42 73.28,2.49 C21.1 | v79.07,6.15 88.29,15.37 91.41,15.37 R6.1
DIS_CS  (via drill 0.35)
  Top 0.152: v34.49,31.83 IC3.20 | v66.88,18.64 67.49,19.25 67.49,20.17 66.88,20.78 65.58,20.78 U1.8 | J1.6 85.09,23.14 85.01,23.22 85.01,23.82 85.4,24.21 88.29,24.21 v88.98,24.89
  Route15 0.152: v28.78,21.62 21.62,14.45 21.62,2.56 SV2.5 | v66.88,18.64 63.37,18.64 62.92,19.1 48.67,19.1 40.82,26.95 v38.61,26.95 | v88.98,24.89 89.2,24.89 91.19,22.91 92.02,22.91 92.79,22.15 92.79,18.49 86.77,12.47 67.11,12.47 v64.14,15.44
  Bottom 0.152: 34.49,31.45 v34.49,31.83 | 34.49,31.45 32.97,29.92 32.97,25.81 v28.78,21.62 | v38.61,26.95 36.93,28.63 36.63,28.63 35.1,30.15 35.1,30.84 34.49,31.45 | v64.14,15.44 64.14,15.75 64.75,16.36 64.75,16.97 66.42,18.64 v66.88,18.64
DIS_MODE  (via drill 0.35)
  Top 0.152: v82.58,25.42 79.91,25.42 76.86,22.38 74.19,22.38 U1.32 | v82.58,20.55 82.58,19.1 83.03,18.64 J1.9 | v27.56,23.22 27.33,23.44 27.33,24.21 IC3.10
  Route15 0.152: v82.58,25.42 v82.58,20.55 79.68,20.55 76.71,17.58 59.94,17.58 57.66,15.29 38.84,15.29 31.9,22.23 27.56,22.23 | 27.56,22.23 27.56,20.85 19.1,12.39 19.1,2.56 SV2.4 | 27.56,22.23 v27.56,23.22
DIS_RESET  (via drill 0.35)
  Top 0.152: v73.28,25.12 73.28,25.2 72.67,25.81 U1.37 | v85.62,23.52 85.62,22.99 86.08,22.53 86.08,22.07 J1.4 | v30.53,21.54 29.85,22.23 29.85,24.21 IC3.12
  Route2 0.152: v73.28,25.12 81.97,25.12 83.57,23.52 v85.62,23.52
  Route15 0.152: v85.62,23.52 85.62,25.58 85.4,25.81 85.4,29.54 85.93,30.07 86.84,30.07 90.42,26.49 90.42,26.26 91.26,25.42 92.02,25.42 93.4,24.05 93.4,18.19 76.4,1.19 25.43,1.19 24.13,2.49 SV2.6
  Bottom 0.152: v30.53,21.54 30.53,8.97 24.13,2.56 SV2.6
DIS_SDO  (via drill 0.35)
  Top 0.152: SJ3.2 14.22,8.89 15.06,8.05 v15.06,6.3
  Route15 0.152: v15.06,6.3 15.06,3.63 SV2.2
EXT_INT2  (via drill 0.35)
  Top 0.152: v72.59,24.51 73.2,23.9 74.12,23.9 U1.35 74.19,23.9 74.95,23.9 77.62,26.57 77.62,31.29 v78.69,32.36
  Route15 0.152: v69.93,27.63 69.93,27.18 v72.59,24.51
  Bottom 0.152: v69.93,27.63 69.93,29.92 70.23,30.23 70.31,30.23 IC1.5 | v78.69,32.36 78.69,35.1 J4.5
EXT_SW2  (via drill 0.35)
  Top 0.152: v13.77,39.45 14.83,39.45 IC3.41 | v53.54,16.81 55.6,16.81 55.64,16.85 | 55.64,16.85 60.1,21.31 65.51,21.31 U1.7 | v84.33,32.28 84.1,32.05 84.1,30.91 J2.8 | v58.5,12.62 57.66,12.62 57.12,13.16 57.12,14.83 56.82,15.14 56.67,15.14 55.68,16.13 55.68,16.81 55.64,16.85
  Route15 0.152: v13.77,39.45 13.77,37.85 15.29,36.32 15.29,24.89 17.58,22.61 v17.58,22.15 | v36.17,17.04 v27.86,17.04 | v77.55,6.83 64.29,6.83 v58.5,12.62
  Bottom 0.152: v17.58,22.15 22.76,22.15 v27.86,17.04 | v36.17,17.04 51.56,17.04 51.79,16.81 v53.54,16.81 | v84.33,32.28 86.16,32.28 90.73,27.71 92.63,27.71 93.24,27.1 93.24,14.99 91.87,13.61 87.45,13.61 79.38,5.54 78.77,5.54 77.55,6.76 v77.55,6.83
GREEN_LED  (via drill 0.35)
  Top 0.152: v29.69,32.28 29.16,32.28 24.82,36.63 24.82,36.93 22.23,39.52 22.23,40.59 IC3.35 | v73.28,16.97 74.12,17.8 74.12,18.8 U1.25 | R2.2 66.95,35.56 64.52,33.12 63.75,33.12 60.1,29.46 58.65,29.46 58.42,29.69 58.42,33.66 58.5,33.73 58.5,36.78 55.91,39.37 GLED.TP
  Route15 0.152: v29.69,32.28 34.04,32.28 36.78,35.03 37.16,35.03 39.75,37.62 50.95,37.62 52.7,39.37 GLED.TP 55.91,39.37 55.91,29.92 66.57,19.25 v68.78,19.25
  Bottom 0.152: v73.28,16.97 71.07,16.97 v68.78,19.25
IMU_CS  (via drill 0.35)
  Top 0.152: v70.54,28.7 70.54,25.88 U1.41 | v15.9,29.84 15.9,29.62 15.6,29.31 14.91,29.31 IC3.49 | v79.3,37.08 77.39,37.08 72.82,32.51 v71.83,32.51
  Route15 0.152: v75.95,19.1 75.95,23.37 70.61,28.7 v70.54,28.7 71.83,30 v71.83,32.51 63.14,41.2 21.39,41.2 19.79,39.6 19.79,39.29 16.74,36.25 16.43,36.25 15.9,35.71 v15.9,29.84
  Bottom 0.152: v71.83,32.51 71.83,31.29 IC1.10 | v75.95,19.1 75.95,20.17 AC1.5 | v79.3,37.08 80.67,35.71 80.67,35.18 J4.9
IMU_INT2_SIG
  Top 0.152: SV5.2 8.13,23.37 8.13,30.61 11.1,33.58 11.48,33.58 13.54,35.64 14.83,35.64 IC3.44
INDX2  (via drill 0.35)
  Top 0.152: v24.74,39.6 24.74,40.59 IC3.33 | v65.96,28.78 68.1,26.64 68.1,25.88 U1.46 | J2.6 85.09,30.38 84.48,29.77 v81.66,29.77
  Route2 0.152: v24.74,39.6 26.11,40.97 56.52,40.97 65.32,32.17 | 65.32,32.17 65.96,31.52 v65.96,28.78 | v65.35,32.21 65.32,32.17
  Route15 0.152: v81.66,29.77 76.25,29.77 72.9,33.12 v72.52,33.12
  Bottom 0.152: v72.52,33.12 69.16,33.12 68.25,32.21 v65.35,32.21
MCLR_SIG  (via drill 0.35)
  Top 0.152: 46.8,34.84 46.99,35.03 46.99,40.13 46.15,40.97 39.14,40.97 38.3,40.13 34.87,40.13 34.19,39.45 IC3.26 | 46.8,34.84 46.76,34.8 45.85,34.8 45.09,35.56 C28.1 | 61.77,26.11 61.39,26.11 59.41,24.13 R4.2 | 61.77,26.11 63.37,26.11 63.68,25.81 63.68,23.98 64.75,22.91 65.51,22.91 U1.4 65.58,22.84 66.42,22.84 67.72,21.54 v68.17,21.54 | 46.8,34.84 47.68,33.96 49.66,33.96 50.27,34.57 50.27,34.72 50.88,35.33 53.39,35.33 v56.82,31.9 | 61.77,26.11 v61.77,26.72
  Route15 0.152: v79.07,19.02 91.41,19.02 JP2.1 | v68.17,21.54 v70.31,19.41 | v56.82,31.9 56.82,31.67 v61.77,26.72
  Bottom 0.152: v79.07,19.02 76.78,19.02 76.25,18.49 73.51,18.49 72.59,19.41 v70.31,19.41
N$1
  Top 0.152: LED1.A 61.77,38.15 63.83,38.15 65.05,39.37 R1.1
N$2
  Top 0.152: R2.1 63.07,35.56 61.01,37.62 61.01,38.53 61.7,39.22 61.7,40.59 LED2.A
N$3
  Top 0.152: C6.1 57.51,30.45 57.51,29.77 59.33,27.94 R3.1 | R4.1 57.51,24.13 57.51,26.19 59.26,27.94 R3.1 | JP1.1 69.85,37.69 67.87,35.71 67.87,34.65 66.04,32.82 64.29,32.82 59.41,27.94 R3.1
N$4
  Bottom 0.152: U2.1 65.73,13.69 71.07,13.69 C8.1
N$7
  Bottom 0.152: AC1.10 78,28.09 78,28.24 78.92,29.16 82.8,29.16 C12.1
N$8
  Bottom 0.152: ETH_5V.TP 10.72,33.58 28.17,33.58 30.68,36.09 37.08,36.09 38.08,35.1 39.06,35.1 40.74,36.78 52.02,36.78 SV1.7
N$9
  Bottom 0.152: C13.1 82.5,16.51 78.99,20.02 78.99,20.17 AC1.2
N$12
  Top 0.152: IC2.5 53.7,3.17 54.53,4.01 54.53,7.44 52.17,9.8 44.17,9.8 42.72,11.25 36.4,11.25 35.56,10.41 SJ1.2
N$13
  Top 0.152: IC2.8 52.32,6.98 49.81,9.5 43.87,9.5 43.26,8.89 36.63,8.89 35.56,7.82 SJ2.2
N$15
  Top 0.152: CAN_TERM.2 R5.2
OSC_MCU  (via drill 0.35)
  Top 0.152: v20.85,29.31 20.4,29.77 20.4,30.07 IC3.53 | v72.29,18.8 73.28,19.79 74.12,19.79 U1.27 | v52.09,17.42 52.09,16.13 OS1.3
  Route15 0.152: v20.85,29.31 21.62,29.31 24.97,25.96 29.92,25.96 31.22,24.66 39.9,24.66 40.67,23.9 42.11,23.9 45.7,20.32 OSCI.TP 45.77,20.32 48.21,17.88 52.09,17.88 | v72.29,18.8 69.24,18.8 68.33,17.88 52.09,17.88 | 52.09,17.88 v52.09,17.42
OSC_OUT  (via drill 0.35)
  Top 0.152: v19.1,31.67 19.63,31.14 19.63,30.84 IC3.54
  Route15 0.152: v19.1,31.67 19.1,32.21 18.49,32.82 18.49,36.32 19.56,37.39 34.57,37.39 v35.18,38 | v52.09,39.9 v43.56,39.9 | v73.51,37.31 v70.38,37.31
  Bottom 0.152: v35.18,38 35.94,38 36.78,38.84 42.49,38.84 v43.56,39.9 | v52.09,39.9 54.69,37.31 v70.38,37.31 | v73.51,37.31 74.04,37.31 76.33,39.6 77.17,39.6 77.7,39.06 77.7,38.53 J4.4
PGC_C1RX  (via drill 0.35)
  Top 0.152: 21.16,12.09 21.16,10.79 S1.2 | 21.16,12.09 21.16,16.81 20.93,17.04 20.93,18.26 21.01,18.34 21.01,20.4 19.25,22.15 18.49,22.15 17.2,23.44 17.2,24.21 IC3.2 | v65.35,16.66 65.66,16.36 66.57,16.36 67.03,16.81 67.03,17.27 U1.13 | v84.18,13.99 90.73,20.55 92.63,20.55 93.24,21.16 93.24,27.41 JP2.5 | 21.16,12.09 39.29,12.09 v41.58,14.38
  Route15 0.152: v84.18,13.99 83.57,13.39 75.49,13.39 73.13,15.75 66.57,15.75 65.66,16.66 v65.35,16.66 65.05,16.97 63.45,16.97 60.86,14.38 v41.58,14.38
PGD_C1TX  (via drill 0.35)
  Top 0.152: IC3.52 14.83,25.42 14.83,24.05 15.98,22.91 15.98,22.61 17.73,20.85 18.03,20.85 20.62,18.26 20.62,15.82 20.32,15.52 S1.5 20.32,12.17 19.48,11.33 19.48,8.58 21.16,6.91 v27.56,6.91 | v62.61,18.49 65.05,16.05 67.11,16.05 67.56,16.51 67.56,17.27 U1.14
  Route2 0.152: v62.61,18.49 66.12,18.49 66.57,18.03 79.15,18.03 84.02,22.91 86.08,22.91 89.05,25.88 90.35,25.88 91.11,26.64 91.41,26.64 JP2.4
  Route15 0.152: v38.23,6.91 v27.56,6.91
  Bottom 0.152: v38.23,6.91 45.77,6.91 50.11,11.25 62.15,11.25 64.29,13.39 64.29,14.15 66.5,16.36 66.57,16.36 67.49,17.27 67.49,18.95 67.18,19.25 63.37,19.25 v62.61,18.49
PWM1EN
  Top 0.152: J3.5 85.09,36.93 85.7,37.54 87.45,37.54 88.06,36.93 88.06,26.95 85.62,24.51 79.91,24.51 76.78,21.39 74.19,21.39 U1.30
PWM1ER
  Top 0.152: U1.36 74.19,24.36 74.19,27.18 77.32,30.3 77.32,31.9 79.68,34.27 84.48,34.27 86.08,35.87 86.08,36.4 J3.3
PWM1H  (via drill 0.35)
  Top 0.152: IC3.15 33.43,25.5 34.65,25.5 36.7,23.44 37.85,23.44 39.6,21.69 51.94,21.69 52.02,21.62 SV1.1 | v64.67,26.11 65.89,24.89 66.27,24.89 66.57,24.59 66.57,24.05 66.42,23.9 65.58,23.9 U1.2 | v76.78,33.73 77.93,34.87 80.52,34.87 82.04,36.4 83.03,36.4 J3.9 | v69.77,35.48 69.62,35.48 60.55,26.42 v60.55,26.19
  Route15 0.152: v64.67,26.11 60.63,26.11 v60.55,26.19 | v76.78,33.73 73.28,33.73 71.53,35.48 v69.77,35.48
  Bottom 0.152: v60.55,26.19 56.67,26.19 SV1.1
PWM1L  (via drill 0.35)
  Top 0.152: v32.36,28.55 29.01,28.55 26.04,25.58 IC3.9 | v67.49,23.37 65.58,23.37 U1.3 | v76.33,32.36 78.54,34.57 82.73,34.57 84.02,35.87 84.02,36.4 J3.7
  Route2 0.152: v76.33,32.36 73.43,29.46 73.43,28.93 69.16,24.66 69.16,24.21 68.48,23.52 67.64,23.52 v67.49,23.37
  Route15 0.152: v32.36,28.55 34.42,28.55 34.49,28.63 39.9,28.63 40.44,29.16 52.02,29.16 SV1.4 52.09,29.16 60.55,20.7 v61.77,20.7
  Bottom 0.152: v67.49,23.37 64.44,23.37 v61.77,20.7
PWM4EN
  Top 0.152: J3.6 85.09,39.29 84.18,38.38 83.57,38.38 81.36,36.17 77.47,36.17 72.9,31.6 72.06,31.6 68.63,28.17 68.63,25.88 U1.45
PWM4ER  (via drill 0.35)
  Top 0.152: v74.5,15.75 72.9,15.75 72.14,16.51 72.14,17.27 U1.23 | v89.66,16.74 91.34,16.74 93.55,18.95 93.55,31.9 86.77,38.68 86.69,38.68 86.16,39.22 86.16,39.75 J3.4
  Route15 0.152: v74.5,15.75 88.67,15.75 v89.66,16.74
PWM4H  (via drill 0.35)
  Top 0.152: v66.27,26.64 67.03,25.88 U1.48 | v64.36,29.01 64.82,29.01 68.1,32.28 69.39,32.28 76.4,39.29 82.58,39.29 83.03,39.75 J3.10
  Route15 0.152: v66.27,26.64 66.27,27.1 v64.36,29.01
PWM4L
  Top 0.152: U1.1 65.51,24.36 64.06,25.81 64.06,27.79 68.17,31.9 72.75,31.9 77.32,36.47 81.2,36.47 83.41,38.68 83.49,38.68 84.02,39.22 84.02,39.75 J3.8
QEA2  (via drill 0.35)
  Top 0.152: v76.48,30.45 71.37,30.45 69.16,28.24 69.16,25.88 U1.44 | v78.99,30.45 80.06,30.45 81.36,29.16 85.85,29.16 86.19,29.5 | 86.19,29.5 87.07,30.38 87.07,30.84 J2.2 | v34.8,28.02 IC3.17 | v86.23,29.46 86.19,29.5
  Route15 0.152: v78.99,30.45 v76.48,30.45 | v86.23,29.46 86.23,28.85 89.97,25.12 91.87,25.12 93.09,23.9 93.09,18.34 76.25,1.5 32.74,1.5 31.75,2.49 SV2.9
  Bottom 0.152: v34.8,28.02 34.8,24.13 32.28,21.62 32.28,3.1 31.75,2.56 SV2.9
QEB2  (via drill 0.35)
  Top 0.152: IC3.16 33.43,26.72 34.72,26.72 36.78,24.66 37.54,24.66 v38.53,23.67 38.53,23.75 38.68,23.9 41.35,23.9 42.57,25.12 53.31,25.12 55.37,23.06 60.1,23.06 62.54,25.5 v63.07,25.5 | v66.19,25.5 66.88,24.82 67.34,24.82 67.56,25.04 67.56,25.81 U1.47 | v79.38,32.97 84.56,32.97 86.08,31.45 86.08,30.91 J2.4
  Route2 0.152: v79.38,32.97 76.02,32.97 74.27,31.22 74.27,31.14 72.97,29.84 70.54,29.84 v66.19,25.5
  Route15 0.152: v63.07,25.5 v66.19,25.5
  Bottom 0.152: v38.53,23.67 38.53,22.15 33.27,16.89 33.27,3.56 SV2.10
RED_LED  (via drill 0.35)
  Top 0.152: v32.36,31.14 32.36,31.9 31.98,32.28 31.67,32.28 31.22,32.74 31.22,33.05 26.87,37.39 26.04,37.39 23.52,39.9 23.52,40.59 IC3.34 | v65.28,37.92 65.51,37.92 66.95,39.37 R1.2 | v71.22,20.02 71.83,19.41 72.44,19.41 73.36,20.32 74.12,20.32 U1.28
  Route15 0.152: v32.36,31.14 39.83,31.14 40.67,31.98 45.77,31.98 51.71,37.92 54.3,37.92 | v54.99,37.92 54.3,37.92 | v68.33,22.91 v71.22,20.02 | 54.3,37.92 v54.3,30.91
  Bottom 0.152: v65.28,37.92 v54.99,37.92 | v68.33,22.91 68.33,23.44 66.88,24.89 64.59,24.89 61.24,28.24 56.97,28.24 v54.3,30.91
SCK1  (via drill 0.35)
  Top 0.152: v72.14,20.02 72.14,22.15 73.28,23.29 74.12,23.29 U1.34 | v81.66,22.99 82.58,22.99 82.73,23.14 83.49,23.14 84.02,22.61 84.02,22.07 J1.8 | v32.36,33.66 32.36,33.43 32.66,33.12 33.35,33.12 IC3.21
  Route15 0.152: v81.66,22.99 76.86,18.19 75.49,18.19 73.66,20.02 v72.14,20.02 72.14,20.78 69.16,23.75 69.16,26.95 68.63,27.48 68.63,33.2 61.24,40.59 41.81,40.59 39.75,38.53 38.08,38.53 36.93,37.39 35.94,37.39 32.21,33.66 | 32.21,33.66 23.98,33.66 23.44,33.12 23.44,32.82 22.91,32.28 22.38,32.28 20.24,30.15 20.24,28.78 20.85,28.17 20.85,14.6 16.51,10.26 SV2.3 | 32.21,33.66 v32.36,33.66
SCK2  (via drill 0.35)
  Top 0.152: 72.82,27.71 72.82,27.33 72.14,26.64 72.14,25.88 U1.38 | 72.82,27.71 v72.82,29.23 | v75.26,29.16 75.26,28.93 74.04,27.71 72.82,27.71 | v13.77,36.93 14.83,36.93 IC3.43
  Bottom 0.152: 72.1,30.19 72.82,29.46 v72.82,29.23 | 72.1,30.19 72.06,30.23 71.91,30.23 IC1.12 | v75.26,29.16 75.95,28.47 75.95,28.09 AC1.8 | v13.77,36.93 15.6,36.93 16.28,36.25 18.41,36.25 18.8,36.63 21.01,36.63 21.39,36.25 25.58,36.25 26.11,36.78 26.11,37.08 29.46,40.44 39.83,40.44 40.51,41.12 71.37,41.12 | 71.37,41.12 78.69,41.12 80.67,39.14 80.67,38.53 J4.10 | 72.1,30.19 73.05,31.14 73.05,32.74 73.13,32.82 73.13,36.4 71.37,38.15 71.37,41.12
SDI1  (via drill 0.35)
  Top 0.152: 75.79,16.36 83.34,16.36 85.09,18.11 J1.5 | 75.79,16.36 72.97,16.36 72.67,16.66 72.67,17.27 U1.24 | v34.49,30.53 33.43,30.53 IC3.19 | 75.79,16.36 75.79,6.45 75.95,6.3 75.95,3.86 75.26,3.17 54.99,3.17 54.38,2.56 51.41,2.56 48.97,5 43.56,5 43.33,4.77 13.69,4.77 11.48,2.56 SV2.1
  Bottom 0.152: v34.49,30.53 34.49,28.63 33.27,27.41 33.27,25.2 29.31,21.23 29.31,17.58 16.05,4.32 13.23,4.32 11.48,2.56 SV2.1
SDI2  (via drill 0.35)
  Top 0.152: v71.14,22.68 71.14,25.81 U1.40 71.14,25.88 71.14,28.93 72.37,30.15 73.28,30.15 73.97,29.46 v74.35,29.46 | IC3.27 32.36,40.59 32.36,35.03 32.59,34.8 32.66,34.8 32.82,34.95 34.04,34.95 36.55,32.44 36.93,32.44 38.46,30.91 38.46,30.45 39.67,29.23 41.58,29.23 44.09,26.72 45.01,26.72 C27.1 45.09,26.64 46.23,25.5 v56.9,25.5
  Route2 0.152: v71.14,22.68 v68.63,20.17 68.63,20.24 67.41,20.24 62.15,25.5 v56.9,25.5
  Bottom 0.152: 74.16,29.65 75.72,31.22 75.72,34.11 76.71,35.1 J4.1 | 74.16,29.65 73.13,28.63 72.52,28.63 71.91,29.23 71.91,29.69 IC1.1 | v68.63,20.17 69.09,20.62 72.44,20.62 72.82,20.24 74.95,20.24 AC1.6 | v74.35,29.46 74.16,29.65
SDO1  (via drill 0.35)
  Top 0.152: v83.49,25.12 83.19,24.82 79.76,24.82 76.78,21.84 74.19,21.84 U1.31 | v84.4,20.55 84.4,18.95 84.1,18.64 J1.7 | v44.17,38.23 44.25,38.15 45.01,38.15 C31.1 | v14,11.56 14,10.41 SJ3.3
  Route2 0.152: v20.02,20.47 22.68,23.14 22.68,23.52 25.27,26.11 25.65,26.11 31.22,31.67 31.22,31.98 31.67,32.44 32.06,32.44 34.72,35.1 v34.72,35.25
  Route15 0.152: v84.4,20.55 83.49,21.46 v83.49,25.12 83.49,29.54 79.98,33.05 79.98,33.27 75.26,38 v67.26,38 | v44.17,38.23 38.99,38.23 36.86,36.09 35.56,36.09 v34.72,35.25 | v14,11.56 14,14.45 v20.02,20.47
  Bottom 0.152: v67.26,38 66.12,38 63.37,40.74 46.69,40.74 v44.17,38.23
SDO2  (via drill 0.35)
  Top 0.152: 42.88,36.85 37.62,36.85 37.08,37.39 34.65,37.39 34.19,36.93 33.43,36.93 IC3.24 | 42.88,36.85 45.01,36.85 C30.1 | v73.74,28.32 73.74,29.23 73.13,29.84 72.52,29.84 71.6,28.93 71.6,25.88 U1.39 | 42.88,36.85 42.88,31.22 43.64,30.45 53.16,30.45 v56.29,27.33
  Route2 0.152: v56.29,27.33 67.56,27.33 71.68,31.45 v73.66,31.45
  Route15 0.152: v73.66,31.45 73.66,28.4 v73.74,28.32
  Bottom 0.152: 73.74,28.09 74.95,28.09 AC1.7 | 73.74,28.09 72.59,28.09 71.37,29.31 IC1.2 | 73.74,28.09 v73.74,28.32 | v73.66,31.45 73.66,33.58 76.71,36.63 76.71,38.46 J4.2
TP1_SIG  (via drill 0.35)
  Top 0.152: v19.1,36.02 18.11,36.02 16.74,37.39 16.43,37.39 15.67,38.15 14.91,38.15 IC3.42 | TP1.TP 57.35,16.51 59.64,14.22 69.93,14.22 70.38,14.68 70.38,15.29 70.54,15.44 70.54,17.27 U1.20
  Route15 0.152: v19.1,36.02 20.02,36.02 20.09,36.09 30.15,36.09 v31.83,34.42
  Bottom 0.152: v31.83,34.42 33.35,34.42 36.7,31.06 37.85,31.06 39.98,28.93 42.49,28.93 54.91,16.51 TP1.TP
TP2_SIG  (via drill 0.35)
  Top 0.152: v61.01,15.75 62.23,14.53 69.77,14.53 70.08,14.83 70.08,17.27 U1.19
  Bottom 0.152: v61.01,15.75 61.01,16.51 57.2,20.32 TP2.TP
U1RX_U3RX  (via drill 0.35)
  Top 0.152: v69.47,15.14 69.55,15.21 69.55,17.27 U1.18 | v86.92,20.55 86.92,21.84 87.07,22 J1.2 | IC3.8 24.82,24.21 24.82,23.44 27.56,20.7 28.63,20.7 34.27,15.06 34.27,13.99 UART_POINTS.1
  Route2 0.152: v69.47,15.14 65.96,15.14 63.22,17.88 61.85,17.88 53.85,25.88 53.16,25.88 52.4,26.64 52.09,26.64 SV1.3
  Route15 0.152: v69.47,15.14 70.31,15.14 72.37,13.08 84.48,13.08 v85.7,14.3 | v47.68,22.3 52.02,26.64 SV1.3
  Bottom 0.152: v85.7,14.3 86.08,14.3 87.22,15.44 87.22,20.24 v86.92,20.55 | v47.68,22.3 44.86,22.3 40.21,17.65 35.87,17.65 34.34,16.13 34.34,13.99 UART_POINTS.1
U1TX_U3TX  (via drill 0.35)
  Top 0.152: IC3.13 31.14,24.21 31.14,19.63 36.78,13.99 UART_POINTS.2 39.98,17.12 49.81,17.12 53.85,21.16 53.85,22 52.09,23.75 52.09,24.13 SV1.2 | v62.54,15.14 62.84,14.83 67.41,14.83 69.09,16.51 69.09,17.27 U1.17 | v78.99,11.86 79.83,11.86 86.08,18.11 86.08,18.57 J1.3
  Route15 0.152: v78.99,11.86 65.81,11.86 v62.54,15.14
  Bottom 0.152: v62.54,15.14 38,15.14 UART_POINTS.2
VBUS  (via drill 0.35)
  Top 0.152: v21.62,21.16 19.71,23.06 19.71,24.21 IC3.4
  Route15 0.152: v21.62,21.16 22.91,21.16 24.05,22.3 24.89,22.3 26.72,24.13 32.21,24.13 36.02,20.32 JP3.1
VBUSON  (via drill 0.35)
  Top 0.152: v19.56,26.19 18.49,25.12 18.49,24.28 IC3.3
  Route15 0.152: v19.56,26.19 19.56,31.14 v23.9,35.48 | v38.76,35.71 38.76,34.87 40.59,33.05 JP3.6
  Bottom 0.152: v23.9,35.48 25.81,35.48 26.57,36.25 30.38,36.25 31.52,37.39 37.08,37.39 v38.76,35.71
VDD  (via drill 0.35)
  Top 0.203: C16.1 44.48,31.45 46.99,31.45 C17.1 47.07,31.45 49.43,31.45 52.02,34.04 SV1.6 52.09,34.27 52.09,34.04 57.43,28.7 57.43,27.94 R3.2 | v68.56,24.51 69.09,24.51 69.55,24.97 69.55,25.81 U1.43 | U1.26 74.19,19.41 75.34,19.41 77.93,22 83.03,22 J1.10 83.11,21.92 83.11,20.93 v83.49,20.55 | v82.19,31.75 83.03,30.91 J2.10 | U1.22 71.6,17.27 71.6,15.67 73.89,13.39 73.89,11.56 L1.2 73.97,11.38 73.97,5.99 74.88,5.08 3.3VDC.3 | v85.47,2.56 86.61,2.56 C7.1 | C15.1 41.89,7.98 39.37,7.98 C14.1 39.29,7.9 39.29,7.06 v38.23,5.99 | IC2.3 48.06,4.39 28.55,4.39 26.72,2.56 SV2.7 | IC3.50 14.83,28.02 14.83,26.8 IC3.51 14.76,26.72 14,26.72 13.77,26.49 13.77,19.41 14,19.18 3.3VTP.TP | C32.1 17.12,19.1 14,19.1 3.3VTP.TP | C24.1 11.18,19.1 13.39,19.1 13.69,19.41 3.3VTP.TP | C25.1 13.69,16.51 13.69,18.64 14,18.95 3.3VTP.TP | JP5.4 3.86,15.29 6.68,15.29 7.67,16.28 10.19,16.28 11.02,15.44 12.62,15.44 13.61,16.43 C25.1 | 61.32,9.12 61.32,10.11 C1.1 | 61.32,9.12 61.32,6.38 C2.1 61.32,6.3 63.14,4.47 v63.14,3.86 | 61.32,9.12 57.35,9.12 56.36,10.11 56.21,10.11 C18.1 56.13,10.18 48.74,10.18 47.07,11.86 OS1.1 | U1.6 65.51,21.77 54.99,21.77 49.35,16.13 46.99,16.13 OS1.4 OS1.1 | OS1.1 46.91,11.86 46.76,11.71 35.33,11.71 34.11,10.49 34.11,10.18 SJ1.1 SJ2.1 33.96,7.59 32.59,6.22 31.52,6.22 | 31.52,6.22 21.31,6.22 19.1,8.43 19.1,10.95 13.69,16.36 C25.1 | 31.52,6.22 v31.52,5.99
  Route15 0.203: v83.49,20.55 84.18,19.86 89.74,19.86 91.41,21.54 JP2.2 | v38.23,5.99 37.77,5.99 35.33,3.56 31.52,3.56 | 31.52,3.56 27.71,3.56 26.72,2.56 SV2.7 | v31.52,5.99 31.52,3.56 | 3.3VDC.3 73.89,5.08 72.67,3.86 v63.14,3.86
  Bottom 0.203: 66.84,29.81 66.5,29.46 64.82,29.46 63.83,30.45 C4.1 63.75,30.38 62,28.63 57.73,28.63 SV1.6 | 66.84,29.81 68.25,31.22 70.31,31.22 IC1.7 | 72.1,28.05 72.9,27.25 76.33,27.25 76.94,27.86 76.94,28.02 AC1.9 77.01,28.09 77.01,28.32 78.46,29.77 80.14,29.77 82.12,31.75 v82.19,31.75 | 72.1,28.05 70.92,29.23 70.92,29.69 IC1.3 | 72.1,28.05 70.34,26.3 | 70.34,26.3 v68.56,24.51 | 70.34,26.3 66.84,29.81 | J4.3 77.78,35.18 77.78,35.71 78.38,36.32 79.15,36.32 79.68,35.79 79.68,35.18 J4.7 79.83,35.1 79.83,34.49 82.19,32.13 v82.19,31.75 | v82.19,31.75 82.27,31.75 82.42,31.6 85.32,31.6 89.66,27.25 89.66,23.67 91.41,21.92 91.41,21.62 JP2.2 91.41,21.54 91.41,21.23 87.61,17.42 87.61,15.29 85.4,13.08 80.06,13.08 C5.1 79.98,13 79.98,10.18 74.95,5.16 3.3VDC.3 74.95,5.08 74.95,4.85 78.31,1.5 79.91,1.5 80.9,2.49 C22.1 81.05,2.56 v85.47,2.56 | v63.14,3.86 63.14,2.56 C19.1
VREF+  (via drill 0.35)
  Top 0.152: v66.27,16.97 65.58,17.65 65.58,18.8 U1.12 | v84.56,26.03 84.56,26.57 84.1,27.03 84.1,27.48 J2.7 | v17.12,31.14 16.36,31.14 15.67,31.83 14.91,31.83 IC3.47
  Route15 0.152: v66.27,16.97 72.37,16.97 75.34,13.99 v76.4,13.99
  Bottom 0.152: U2.6 61.32,12.39 61.32,13 U2.7 61.39,13.08 62.69,13.08 64.1,14.49 | v66.27,16.97 66.27,16.66 64.1,14.49 | v84.56,26.03 84.56,22 86.92,19.63 86.92,15.6 86.23,14.91 83.95,14.91 83.03,13.99 79.22,13.99 77.93,12.7 C9.1 77.09,12.7 76.4,13.39 v76.4,13.99 | v17.12,31.14 18.72,31.14 19.94,29.92 25.58,29.92 26.91,28.59 | 26.91,28.59 28.17,27.33 28.17,19.33 27.94,19.1 VREF_TP.TP | 50.27,35.33 39.75,35.33 39.22,34.8 37.08,34.8 37.01,34.87 35.26,34.87 35.03,34.65 33.58,34.65 33.2,35.03 31.52,35.03 30.3,33.81 30.3,31.98 26.91,28.59 | 50.27,35.33 53.24,35.33 53.85,34.72 53.85,33.05 57.35,29.54 59.64,29.54 C11.1 | 64.1,14.49 61.16,17.42 61.16,26.49 59.72,27.94 55.52,27.94 52.7,30.76 50.88,30.76 50.27,31.37 50.27,35.33
VSS  (via drill 0.2, 0.35)
  Top 0.203: v8.89,21.59 8.89,20.32 9.31,19.9 9.27,19.86 9.27,19.1 C24.2 9.2,19.02 11.71,16.51 C25.2 | 69.47,18.34 70.92,18.34 71.07,18.19 71.07,17.35 U1.21 71.07,17.27 71.07,15.44 70.76,15.14 70.76,14.53 68.25,12.01 68.25,10.26 C3.2 | 69.47,18.34 68.78,18.34 68.63,18.19 68.63,17.35 U1.16 | 68.86,20.85 67.87,20.85 66.42,22.3 65.58,22.3 U1.5 | 68.86,20.85 69.47,20.24 69.47,18.34 | U1.42 70.08,25.81 70.08,22.15 68.86,20.93 68.86,20.85 | 63.14,9.12 63.14,10.11 C1.2 63.14,10.18 62.15,11.18 58.04,11.18 | 63.14,9.12 63.14,6.38 C2.2 | 63.14,9.12 67.11,9.12 68.1,10.11 68.25,10.11 C3.2 | 58.04,11.18 58.04,11.71 56.21,13.54 56.21,13.92 C23.2 56.13,13.54 54.53,11.94 52.09,11.94 OS1.2 | 58.04,11.18 58.04,10.18 C18.2 | 87.15,28.93 87.15,29.39 87.68,29.92 87.68,35.87 87.15,36.4 J3.1 | 87.15,28.93 87.15,27.56 J2.1 | SJ1.3 37.08,10.11 37.31,9.88 39.37,9.88 C14.2 39.45,9.8 41.89,9.8 C15.2 41.96,9.8 v43.26,9.8 | 46.38,28.85 46.38,26.72 C27.2 | 46.38,28.85 46.99,29.46 C17.2 | 46.38,28.85 46.3,28.85 45.7,29.46 44.48,29.46 C16.2 44.4,29.62 41.5,29.62 JP3.5 | LED2.C 60.25,40.59 60.25,38.15 LED1.C 60.25,38.07 60.25,33.73 v60.96,33.02 60.94,32.97 59.41,31.45 59.41,30.53 C6.2 | GND_POINTS.1 88.52,4.19 88.52,2.56 C7.2 | v49.43,5.77 48.13,5.77 IC2.2 | v72.82,21.16 73.13,20.85 74.12,20.85 U1.29 | v37.08,6.22 SJ2.3 | J1.1 87.15,18.64 87.15,19.86 91.41,24.13 JP2.3 | v87.99,39.83 87.15,39.83 J3.2 | v87.07,28.93 87.15,28.93 | C3.2 67.79,9.73 72.44,5.08 3.3VDC.2
  Bottom 0.203: C19.2 61.32,2.49 61.47,2.49 62.46,1.5 65.35,1.5 66.34,2.49 C20.2 66.34,2.64 66.34,10.95 65.66,11.63 U2.4 65.66,11.79 65.66,12.32 U2.3 65.73,12.39 66.34,12.39 66.65,12.7 C8.2 70.23,12.62 71.22,11.63 72.37,11.63 | 72.37,11.63 72.82,11.63 73.89,12.7 C9.2 75.26,12.78 75.26,13.77 76.4,14.91 79.98,14.91 C5.2 80.06,14.99 80.37,15.29 84.78,15.29 86,16.51 C13.2 | AC1.1 79.91,20.24 79.91,20.47 79.38,21.01 78.61,21.01 78,20.4 78,20.24 AC1.3 77.93,20.4 74.77,23.56 | 74.77,23.56 74.57,23.75 69.85,23.75 C10.2 | 74.77,23.56 78.92,27.71 78.92,28.02 AC1.11 78.99,28.09 79.91,28.09 AC1.12 80.06,28.09 83.64,28.09 84.71,29.16 C12.2 84.86,29.16 85.62,29.16 86,28.78 86.92,28.78 v87.07,28.93 | IC1.9 71.3,31.29 70.92,31.29 IC1.8 70.92,31.37 70.92,31.45 70.61,31.75 66.95,31.75 65.73,30.53 C4.2 65.66,30.53 63.22,32.97 61.01,32.97 v60.96,33.02 60.94,32.97 59.72,31.75 59.72,31.45 C11.2 | C21.2 71.45,2.56 71.45,4.17 72.37,5.08 3.3VDC.2 72.37,5.16 72.37,11.63 | C22.2 79.07,2.56 79.22,2.56 82.96,6.3 83.82,6.3 GND_POINTS.2 | J4.8 79.68,38.53 79.68,39.14 78.54,40.28 73.36,40.28 72.44,39.37 JP1.2
  other vias: 25.4,26.67 25.4,29.21 24.13,34.29 22.86,33.02 27.94,31.75 24.13,31.75 25.4,33.02 25.4,30.48 26.67,31.75 25.4,34.29 22.86,31.75 24.13,33.02 24.13,30.48 26.67,33.02 26.67,30.48 29.21,33.02 20.32,33.02 17.78,33.02 20.32,39.37 16.51,39.37 31.75,35.56 24.13,36.83 20.32,35.56 20.32,26.67 25.4,27.94 19.05,33.02 20.32,34.29 19.05,34.29 16.51,33.02 16.51,34.29 16.51,38.1 19.05,39.37 20.32,38.1 22.86,35.56 21.59,36.83 27.94,35.56 26.67,36.83 27.94,34.29 26.67,35.56 25.4,36.83 17.78,34.29 21.59,35.56 21.59,34.29 36.83,38.1 36.83,36.83 36.83,35.56 36.83,34.29 36.83,33.02 36.83,31.75 36.83,30.48 36.83,29.21 36.83,27.94 36.83,26.67 36.83,25.4 36.83,24.13 36.83,22.86 34.29,22.86 15.24,22.86 31.75,22.86 29.21,22.86 26.67,22.86 24.13,22.86 21.59,22.86 19.05,22.86 16.51,22.86 11.43,22.86 11.43,24.13 11.43,25.4 11.43,26.67 11.43,27.94 11.43,29.21 11.43,30.48 11.43,31.75 11.43,33.02 11.43,34.29 11.43,35.56 11.43,36.83 11.43,38.1 11.43,39.37 36.83,39.37 15.24,21.59 16.51,36.83 16.51,35.56 16.51,31.75 16.51,30.48 16.51,29.21 31.75,33.02 31.75,31.75 31.75,30.48 31.75,29.21 31.75,27.94 31.75,26.67 31.75,25.4 31.75,36.83 21.59,38.1 22.86,36.83 17.78,35.56 17.78,39.37 25.4,25.4 26.67,25.4 20.32,27.94 17.78,29.21 11.43,21.59 36.83,21.59 31.75,21.59 24.13,21.59 19.05,21.59 39.37,39.37 17.78,20.32 48.26,39.37
  pour Route2 (no thermals): 1.27,40.64 93.98,40.64 93.98,0 1.27,0
  pour Top (no thermals): 10.16,40.64 38.1,40.64 38.1,20.32 10.16,20.32
  pour Top (no thermals): 39.37,40.64 49.53,40.64 49.53,34.29 43.18,34.29 43.18,38.1 38.1,38.1 38.1,40.64
  pour Top (no thermals): 16.51,20.32 16.51,17.78 20.32,17.78 20.32,20.32
WFI_C15_SIG  (via drill 0.35)
  Top 0.152: v32.59,22.84 32.36,23.06 32.36,24.21 IC3.14
  Route15 0.152: v32.59,22.84 31.6,23.82 26.87,23.82 24.66,21.62 24.66,19.1 v22.91,17.35
  Bottom 0.152: v22.91,17.35 10.26,17.35 7.06,20.55 5.16,20.55 4.24,21.46 4.24,34.72 SV4.2
WFI_SDO1  (via drill 0.35)
  Top 0.152: v22.68,38.15 23.44,37.39 23.44,36.7 23.9,36.25 24.59,36.25 30.91,29.92 31.83,29.92 32.44,29.31 33.35,29.31 IC3.18 | v12.09,7.37 SJ3.1
  Route15 0.152: v12.09,4.47 v12.09,7.37 12.09,20.17 7.59,24.66 7.59,33.05 SV4.3
  Bottom 0.152: v22.68,38.15 22.3,38.15 21.77,38.68 10.72,38.68 6.38,34.34 SV4.3

### Text on the board
Top: NSASPOOK@NSASPOOK.COM | CAN-FD ON | PIC32MK-CANFD HOST V1.9